# EasyEDA Pro project ProPrj_FocKnob_2025-06-09.epro

# Schematic Schematic1
Board Name: base; Create Date: 2025-02-16; Page Name: base_sch; Project Name: FocKnob; Schematic Name: Schematic1; Update Date: 2025-02-24; Page Size: A3; Version: V1.0
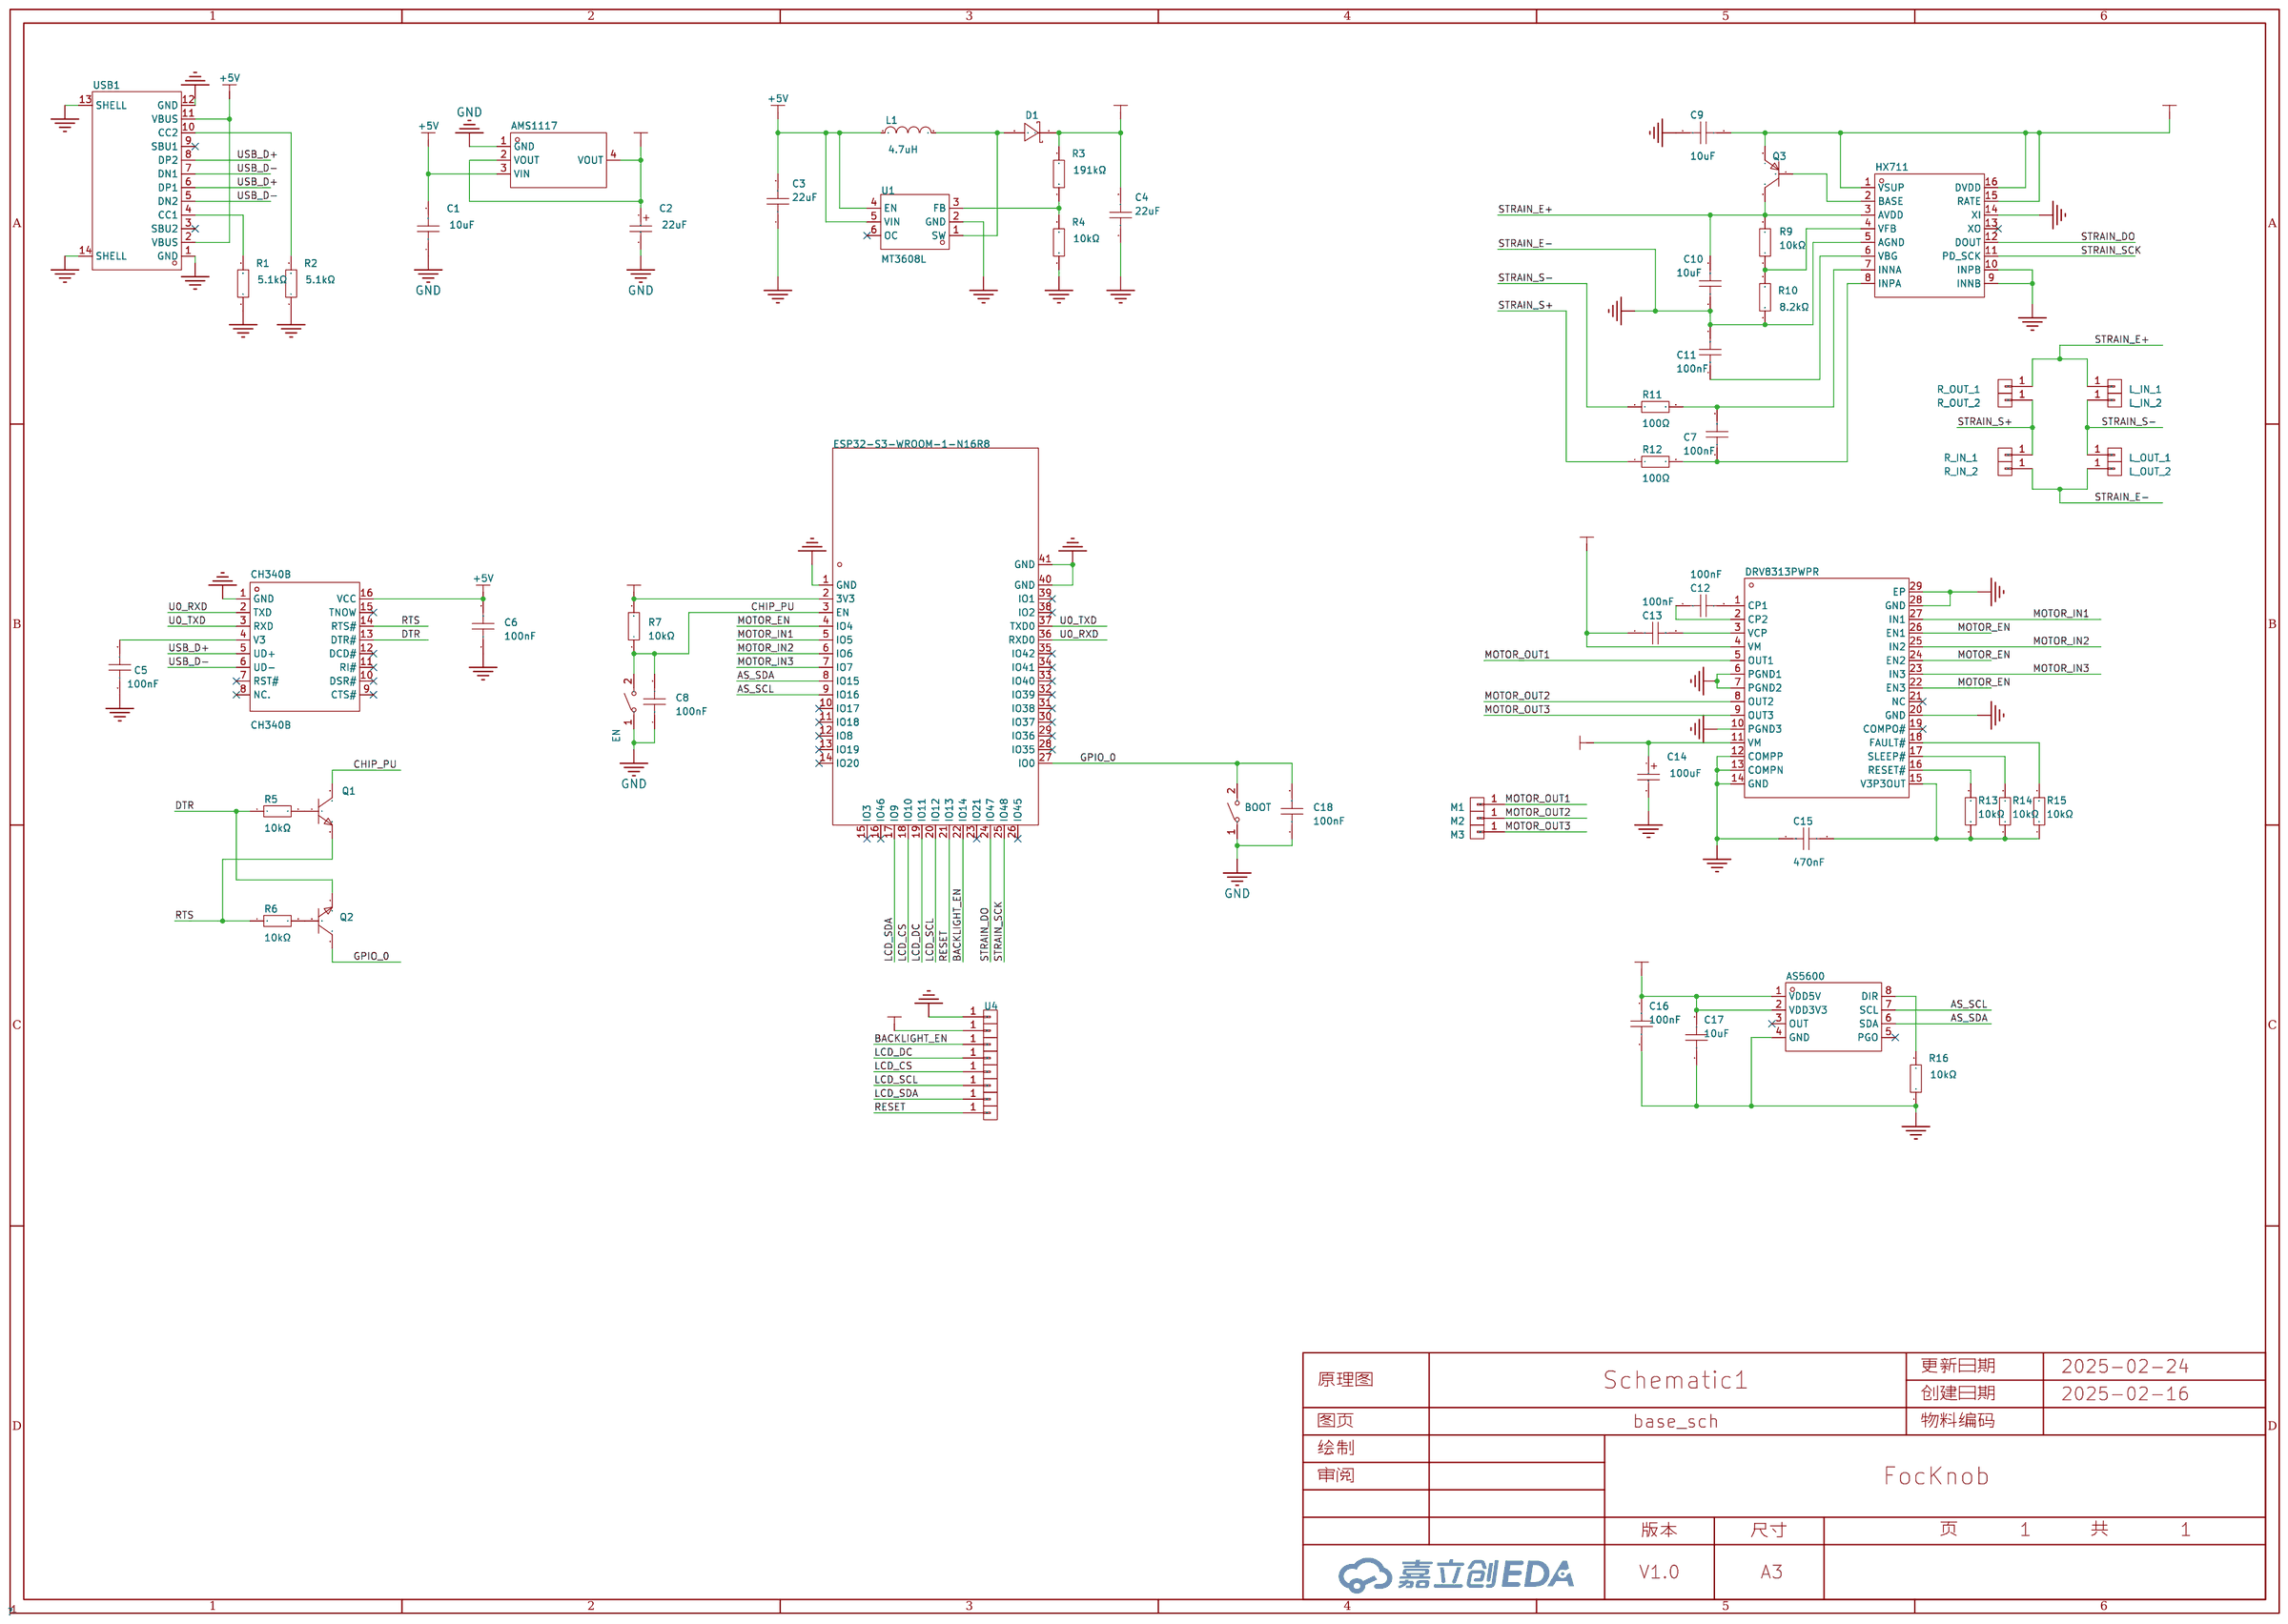
[diagram p0: schematic sheet]

## Parts
AMS1117  AMS1117-3.3  [SOT-223-3_L6.5-W3.4-P2.30-LS7.0-BR]
AS5600  AS5600-ASOT  [SOIC-8_L5.0-W4.0-P1.27-LS6.0-BL]
BOOT  TS-1088R-02026  [SW-SMD_L3.9-W3.0-P4.45]
C1  10uF  [C0603]
C2  22uF  [CASE-A_3216]
C3  22uF  [C0603]
C4  22uF  [C0603]
C5  100nF  [C0603]
C6  100nF  [C0603]
C7  100nF  [C0603]
C8  100nF  [C0603]
C9  10uF  [C0603]
C10  10uF  [C0603]
C11  100nF  [C0603]
C12  100nF  [C0603]
C13  100nF  [C0603]
C14  100uF  [CASE-D_7343]
C15  470nF  [C0603]
C16  100nF  [C0603]
C17  10uF  [C0603]
C18  100nF  [C0603]
CH340B  CH340B  [SOIC-16_L9.9-W3.9-P1.27-LS6.0-BL]
D1  SS14  [SMA_L4.2-W2.6-LS5.3-RD]
DRV8313PWPR  DRV8313PWPR  [HTSSOP-28_L9.8-W4.5-P0.65-LS6.6-BL-EP]
EN  TS-1088R-02026  [SW-SMD_L3.9-W3.0-P4.45]
ESP32-S3-WROOM-1-N16R8  ESP32-S3-WROOM-1-N16R8  [WIRELM-SMD_ESP32-S3-WROOM-1]
HX711  HX711  [SOP-16_L10.0-W3.9-P1.27-LS6.0-BL]
L1  4.7uH  [IND-SMD_L4.4-W4.2]
L_IN_1  -  [pad_1]
L_IN_2  -  [pad_1]
L_OUT_1  -  [pad_1]
L_OUT_2  -  [pad_1]
M1  -  [pad_1]
M2  -  [pad_1]
M3  -  [pad_1]
Q1  S8050  [SOT-23-3_L2.9-W1.3-P1.90-LS2.3-BR]
Q2  S8050  [SOT-23-3_L2.9-W1.3-P1.90-LS2.3-BR]
Q3  S8550  [SOT-23-3_L2.9-W1.3-P1.90-LS2.4-BR]
R1  5.1kΩ  [R0603]
R2  5.1kΩ  [R0603]
R3  191kΩ  [R0603]
R4  10kΩ  [R0603]
R5  10kΩ  [R0603]
R6  10kΩ  [R0603]
R7  10kΩ  [R0603]
R9  10kΩ  [R0603]
R10  8.2kΩ  [R0603]
R11  100Ω  [R0603]
R12  100Ω  [R0603]
R13  10kΩ  [R0603]
R14  10kΩ  [R0603]
R15  10kΩ  [R0603]
R16  10kΩ  [R0603]
R_IN_1  -  [pad_1]
R_IN_2  -  [pad_1]
R_OUT_1  -  [pad_1]
R_OUT_2  -  [pad_1]
U1  MT3608L  [SOT-23-6_L2.9-W1.6-P0.95-LS2.8-BL_3]
U4  -  [pad_1]
U5  -  [pad_1]
U6  -  [pad_1]
U7  -  [pad_1]
U8  -  [pad_1]
U9  -  [pad_1]
U10  -  [pad_1]
U11  -  [pad_1]
USB1  TYPE-C 16PIN 2MD(073)  [USB-C-SMD_TYPE-C-6PIN-2MD-073]

## Library data of the parts
AMS1117 = AMS1117-3.3_C6186: 输出类型:固定;输出极性:正;输出通道数:1;最大输入电压:-;输出电压:3.3V;压差:1.3V@(800mA);静态电流(地电流):-;输出电流:1A;电源纹波抑制比(PSRR):72dB@(120Hz);噪声:-;特性:-;工作温度:-;; LCSC Part Name: 正 Vout=3.3V 1A 72dB@(120Hz); Supplier Part: C6186; Manufacturer: AMS; Supplier Footprint: SOT-223-3; JLCPCB Part Class: Basic Part; Datasheet: https://atta.szlcsc.com/upload/public/pdf/source/20180727/C6186_7A095716F0823C02F1997A905E26C086.pdf; Supplier: LCSC; Output Type: 固定; Output Polarity: 正; Number of Outputs: 1; Output Voltage: 3.3V; Dropout Voltage: 1.3V@(800mA); Output Current: 1A; Power Supply Rejection Ratio (PSRR): 72dB@(120Hz)
AS5600 = AS5600-ASOT: 旋转角度范围:0°~360°;; Supplier Part: C499458; Manufacturer: ams(艾迈斯半导体); Supplier Footprint: SOIC-8; JLCPCB Part Class: 扩展库; Datasheet: https://atta.szlcsc.com/upload/public/pdf/source/20200324/C499458_E1461AFB0CE1042DE5756821C534625C.pdf; Supplier: LCSC; Supply Voltage: 5V；3.3V; Rotation Angle: 0°~360°
BOOT EN = TS-1088R-02026: 电路结构:单刀单掷;按钮形状:圆形按钮;安装方式:立贴;开关长度:3.9mm;开关宽度:2.93mm;开关高度:2mm;触点电流:50mA;额定电压(DC):12V;带灯:-;机械寿命:-;; LCSC Part Name: 3.9*2.93*2mm 立贴 轻触开关; Supplier Part: C455280; Manufacturer: XUNPU(讯普); Supplier Footprint: SMD,3x4mm; JLCPCB Part Class: 扩展库; Datasheet: https://atta.szlcsc.com/upload/public/pdf/source/20191118/C455281_EC5379764BC1462550DF64BBBFEA9579.pdf; Supplier: LCSC; Circuit: 单刀单掷; Actuator Style: 圆形按钮; Mounting Style: 立贴; Switch Length: 3.9mm; Switch Width: 2.93mm; Switch Height: 2mm; Contact Current: 50mA; Voltage Rating (DC): 12V
C1 C8-C10 C17 C18 = CL10A106KP8NNNC: 容值:10uF;精度:±10%;额定电压:10V;材质(温度系数):X5R;; LCSC Part Name: 10uF ±10% 10V; Supplier Part: C19702; Manufacturer: SAMSUNG(三星); Supplier Footprint: 0603; JLCPCB Part Class: Basic Part; Datasheet: https://atta.szlcsc.com/upload/public/pdf/source/20160218/1457707763339.pdf; Supplier: LCSC; Tolerance: ±10%; Voltage Rated: 10V; Temperature Coefficient: X5R
C2 = TAJA226K010RNJ: 容值:22uF;精度:±10%;额定电压:10V;等效串联电阻:3Ω@100kHz;工作温度:-55~+125;; LCSC Part Name: 22uF ±10% 10V; Supplier Part: C11366; Manufacturer: Kyocera AVX; JLCPCB Part Class: Extended Part; Datasheet: https://atta.szlcsc.com/upload/public/pdf/source/20160107/1457707744993.pdf; Supplier: LCSC; Tolerance: ±10%; Rated Voltage: 10V; Equivalent Series Resistance(ESR): 3Ω@100kHz; Operating Temperature: -55~+125
C3 C4 = CGA0603X5R226M160JT: 容值:22uF;精度:±20%;额定电压:16V;材质(温度系数):X5R;; LCSC Part Name: 22uF ±20% 16V; Supplier Part: C6119868; Manufacturer: HRE(芯声); Supplier Footprint: 0603; JLCPCB Part Class: Extended Part; Supplier: LCSC; Tolerance: ±20%; Voltage Rated: 16V; Temperature Coefficient: X5R
C5-C7 C11-C13 C16 = CC0603KRX7R9BB104: 容值:100nF;精度:±10%;额定电压:50V;材质(温度系数):X7R;; LCSC Part Name: 100nF ±10% 50V; Supplier Part: C14663; Manufacturer: YAGEO(国巨); Supplier Footprint: 0603; JLCPCB Part Class: Basic Part; Datasheet: https://atta.szlcsc.com/upload/public/pdf/source/20180910/C282072_33301C7F631E79921B82A8DAC6BCC5B3.pdf; Supplier: LCSC; Tolerance: ±10%; Voltage Rated: 50V; Temperature Coefficient: X7R
C14 = TAJD107K016RNJ: 容值:100uF;精度:±10%;额定电压:16V;等效串联电阻:600mΩ@100kHz;; LCSC Part Name: 100uF ±10% 16V; Supplier Part: C7223; Manufacturer: Kyocera AVX; Supplier Footprint: CASE-D-7343; JLCPCB Part Class: Extended Part; Datasheet: https://atta.szlcsc.com/upload/public/pdf/source/20160107/1457707750344.pdf; Supplier: LCSC; Tolerance: ±10%; Rated Voltage: 16V; Equivalent Series Resistance(ESR): 600mΩ@100kHz; Operating Temperature: -55℃~+125℃
C15 = CL10B474KA8NNNC: 容值:470nF;精度:±10%;额定电压:25V;材质(温度系数):X7R;; LCSC Part Name: 470nF ±10% 25V; Supplier Part: C1623; Manufacturer: SAMSUNG(三星); Supplier Footprint: 0603; JLCPCB Part Class: Basic Part; Datasheet: https://atta.szlcsc.com/upload/public/pdf/source/20160218/1457707763339.pdf; Supplier: LCSC; Tolerance: ±10%; Voltage Rated: 25V; Temperature Coefficient: X7R
CH340B = CH340B: 应用功能:收发器;接口协议:USB 2.0;数据速率:2Mbps;; Supplier Part: C81010; Manufacturer: WCH(南京沁恒); Supplier Footprint: SOP-16; JLCPCB Part Class: 扩展库; Datasheet: https://atta.szlcsc.com/upload/public/pdf/source/20240313/C9CDB4B2542990A8DD7A323D09462BC5.pdf; Supplier: LCSC; Applications Function: 收发器; Protocol: USB 2.0; Supply Voltage: 3.3V；5V; Data Rate: 2Mbps
D1 = SS14_C2480: 二极管配置:独立式;正向压降(Vf):550mV@1A;直流反向耐压(Vr):40V;整流电流:1A;; LCSC Part Name: 电压:40V 电流:1A; Supplier Part: C2480; Manufacturer: MDD(辰达半导体); Supplier Footprint: SMA(DO-214AC); JLCPCB Part Class: 基础库; Datasheet: https://atta.szlcsc.com/upload/public/pdf/source/20240710/EF24798823EE33D63F154ED67BAC5E71.pdf; Supplier: LCSC; Diode Configuration: 独立式; Forward Voltage (Vf@If): 550mV@1A; Reverse Voltage (Vr): 40V; Rectified Current: 1A; Reverse Leakage Current (Ir): 300uA@40V
DRV8313PWPR = DRV8313PWPR: DRV8313 具有集成 FET、65V 最大电压、3A 峰值电流的三相电机驱动器; LCSC Part Name: 无刷直流BLDC电机驱动芯片 60V; Supplier Part: C92482; Manufacturer: TI(德州仪器); Supplier Footprint: HTSSOP-28-EP-4.5mm; JLCPCB Part Class: 扩展库; Datasheet: https://www.ti.com/cn/lit/gpn/drv8313; Supplier: LCSC
ESP32-S3-WROOM-1-N16R8 = ESP32-S3-WROOM-1-N16R8: LCSC Part Name: 通用型Wi-Fi+低功耗蓝牙MCU模组; Supplier Part: C2913202; Manufacturer: ESPRESSIF(乐鑫); Supplier Footprint: SMD,18x25.5mm; JLCPCB Part Class: 扩展库; Datasheet: https://atta.szlcsc.com/upload/public/pdf/source/20220705/4E799F39581577F766659887F738A439.pdf; Supplier: LCSC
HX711 = HX711_C6705483: 分辨率:24位;电源电压:2.7V~5.5V;; Supplier Part: C6705483; Manufacturer: AVIA(海芯科技); Supplier Footprint: SOP-16; JLCPCB Part Class: 扩展库; Datasheet: https://atta.szlcsc.com/upload/public/pdf/source/20240910/523FF17855B2F1313F971C77291F913D.pdf; Supplier: LCSC; resolution: 24位; number of channels: 2; Supply Voltage: 2.7V~5.5V; differential input: 是; Operating Temperature: -40~+85
L1 = FXL0420-4R7-M: 电感值:4.7uH;精度:±20%;额定电流:2.8A;饱和电流(Isat):3A;类型:一体成型电感;; LCSC Part Name: 4.7uH ±20% 3A; Supplier Part: C167208; Manufacturer: cjiang(长江微电); Supplier Footprint: SMD,4.2x4.4mm; JLCPCB Part Class: Extended Part; Datasheet: https://atta.szlcsc.com/upload/public/pdf/source/20240426/3189EA8206330E2108542F9E34E540E7.pdf; Supplier: LCSC; Tolerance: ±20%; Rated Current: 2.8A; Saturation Current (Isat): 3A; DC Resistance (DCR): 105mΩ; Type: 一体成型电感
L_IN_1 L_IN_2 L_OUT_1 L_OUT_2 M1-M3 R_IN_1 R_IN_2 R_OUT_1 R_OUT_2 U4-U11 = pad_1
Q1 Q2 = S8050_C20069125: 晶体管类型:NPN;集电极电流(Ic):500mA;集射极击穿电压(Vceo):25V;功率(Pd):300mW;直流电流增益(hFE@Ic,Vce):120@50mA,1.0V;; LCSC Part Name: hFE:200-350，丝印:J3Y; Supplier Part: C20069125; Manufacturer: 宏迦橙; Supplier Footprint: SOT-23; JLCPCB Part Class: Extended Part; Datasheet: https://atta.szlcsc.com/upload/public/pdf/source/20240403/2D78449C96B6E27F13BF8BDF79E27159.pdf; Supplier: LCSC; Transistor Type: NPN; Collector Current (Ic): 500mA; Collector-Emitter Breakdown Voltage (Vceo): 25V; Power Dissipation (Pd): 300mW; DC Current Gain (hFE@Ic,Vce): 120@50mA,1.0V; Transition Frequency (fT): 100MHz; Collector Cut-Off Current (Icbo): 100nA; Collector-Emitter Saturation Voltage (VCE(sat)@Ic,Ib): 600mV@500mA,50mA; Operating Temperature: -55℃~+150℃
Q3 = S8550_C20069126: 晶体管类型:PNP;集电极电流(Ic):500mA;集射极击穿电压(Vceo):25V;功率(Pd):300mW;直流电流增益(hFE@Ic,Vce):120@500mA,1.0V;; LCSC Part Name: hFE:200-350，丝印:2TY; Supplier Part: C20069126; Manufacturer: 宏迦橙; Supplier Footprint: SOT-23; JLCPCB Part Class: Extended Part; Datasheet: https://atta.szlcsc.com/upload/public/pdf/source/20231229/A44F382554E15234B24C32D7C3971EED.pdf; Supplier: LCSC; Transistor Type: PNP; Collector Current (Ic): 500mA; Collector-Emitter Breakdown Voltage (Vceo): 25V; Power Dissipation (Pd): 300mW; DC Current Gain (hFE@Ic,Vce): 120@500mA,1.0V; Transition Frequency (fT): 150MHz; Collector Cut-Off Current (Icbo): 100nA; Collector-Emitter Saturation Voltage (VCE(sat)@Ic,Ib): 500mV@1.0A,50mA; Operating Temperature: -55℃~+150℃
R1 R2 = 0603WAF5101T5E: 电阻类型:厚膜电阻;阻值:5.1kΩ;精度:±1%;功率:100mW;最大工作电压:75V;温度系数:±100ppm/℃;; LCSC Part Name: 5.1kΩ ±1% 100mW 厚膜电阻; Supplier Part: C23186; Manufacturer: UNI-ROYAL(厚声); Supplier Footprint: 0603; JLCPCB Part Class: Basic Part; Datasheet: https://atta.szlcsc.com/upload/public/pdf/source/20200306/C422600_1E6D84923E4A46A82E41ADD87F860B5C.pdf; Supplier: LCSC; Type: 厚膜电阻; Tolerance: ±1%; Power(Watts): 100mW; Overload Voltage (Max): 75V; Temperature Coefficient: ±100ppm/℃; Operating Temperature Range: -55℃~+155℃
R3 = ERA3AEB1913V: 电阻类型:薄膜电阻;阻值:191kΩ;精度:±0.1%;功率:100mW;最大工作电压:75V;温度系数:±25ppm/℃;; LCSC Part Name: 薄膜电阻 191kΩ ±0.1% 100mW; Supplier Part: C491119; Manufacturer: PANASONIC(松下); Supplier Footprint: 0603; JLCPCB Part Class: Extended Part; Datasheet: https://atta.szlcsc.com/upload/public/pdf/source/20200407/C491119_377C38571D4E885D6F5A34CE23F2FBE8.pdf; Supplier: LCSC; Type: 薄膜电阻; Tolerance: ±0.1%; Power(Watts): 100mW; Overload Voltage (Max): 75V; Temperature Coefficient: ±25ppm/℃; Operating Temperature Range: -55℃~+155℃
R4-R7 R9 R13-R16 = 0603WAF1002T5E: 电阻类型:厚膜电阻;阻值:10kΩ;精度:±1%;功率:100mW;最大工作电压:75V;温度系数:±100ppm/℃;; LCSC Part Name: 厚膜电阻 10kΩ ±1% 100mW; Supplier Part: C25804; Manufacturer: UNI-ROYAL(厚声); Supplier Footprint: 0603; JLCPCB Part Class: Basic Part; Datasheet: https://atta.szlcsc.com/upload/public/pdf/source/20200306/C422600_1E6D84923E4A46A82E41ADD87F860B5C.pdf; Supplier: LCSC; Type: 厚膜电阻; Tolerance: ±1%; Power(Watts): 100mW; Overload Voltage (Max): 75V; Temperature Coefficient: ±100ppm/℃; Operating Temperature Range: -55℃~+155℃
R10 = 0603WAF8201T5E: 电阻类型:厚膜电阻;阻值:8.2kΩ;精度:±1%;功率:100mW;最大工作电压:75V;温度系数:±100ppm/℃;; LCSC Part Name: 8.2kΩ ±1% 100mW 厚膜电阻; Supplier Part: C25981; Manufacturer: UNI-ROYAL(厚声); Supplier Footprint: 0603; JLCPCB Part Class: Basic Part; Datasheet: https://atta.szlcsc.com/upload/public/pdf/source/20200306/C422600_1E6D84923E4A46A82E41ADD87F860B5C.pdf; Supplier: LCSC; Type: 厚膜电阻; Tolerance: ±1%; Power(Watts): 100mW; Overload Voltage (Max): 75V; Temperature Coefficient: ±100ppm/℃; Operating Temperature Range: -55℃~+155℃
R11 R12 = 0603WAF1000T5E: 电阻类型:厚膜电阻;阻值:100Ω;精度:±1%;功率:100mW;最大工作电压:75V;温度系数:±200ppm/℃;; LCSC Part Name: 100Ω ±1% 100mW 厚膜电阻; Supplier Part: C22775; Manufacturer: UNI-ROYAL(厚声); Supplier Footprint: 0603; JLCPCB Part Class: Basic Part; Datasheet: https://atta.szlcsc.com/upload/public/pdf/source/20200306/C422600_1E6D84923E4A46A82E41ADD87F860B5C.pdf; Supplier: LCSC; Type: 厚膜电阻; Tolerance: ±1%; Power(Watts): 100mW; Overload Voltage (Max): 75V; Temperature Coefficient: ±200ppm/℃; Operating Temperature Range: -55℃~+155℃
U1 = MT3608L: 工作电压:2.2V~16V;输出电流:2.5A;; LCSC Part Name: 高效2.5A 1.2MHz升压转换器; Supplier Part: C2932326; Manufacturer: 西安航天民芯; Supplier Footprint: SOT-23-6; JLCPCB Part Class: 扩展库; Datasheet: https://atta.szlcsc.com/upload/public/pdf/source/20211213/953A62CC1033762E00AABAD4906DD7F1.pdf; Supplier: LCSC; Input Voltage: 2.2V~16V; Output Current: 2.5A; Number of Outputs: 1
USB1 = TYPE-C 16PIN 2MD(073): 连接器类型:Type-C;标准:USB 3.1;公母:母;安装方式:卧贴;触点数量:16P;端口数量:1;额定电流 - 电源:5A;工作温度范围:-25~+85;; LCSC Part Name: Type-C 母 卧贴; Supplier Part: C2765186; Manufacturer: SHOU HAN(首韩); Supplier Footprint: SMD; JLCPCB Part Class: 扩展库; Datasheet: https://atta.szlcsc.com/upload/public/pdf/source/20211123/39B17C16241EAC15C5E277BDA434118E.pdf; Supplier: LCSC; Connector Type: Type-C; Standard: USB 3.1; Gender: 母; Mounting Style: 卧贴; Number of Contacts: 16P; Number of Ports: 1; Current Rating - Power (Max): 5A; Operating Temperature Range: -25~+85; Rated Voltage (Max): 5V; Connect-Disconnect Life: 5千次; Core Colour: 黑色

## Nets
+3.3V: AMS1117.2(VOUT) AMS1117.4(VOUT) AS5600.1(VDD5V) AS5600.2(VDD3V3) C2.1 C9.2 C16.2 C17.2 ESP32-S3-WROOM-1-N16R8.2(3V3) HX711.1(VSUP) HX711.15(RATE) HX711.16(DVDD) Q3.2(E) R7.2 U5.1(Pin)
+5V: AMS1117.3(VIN) C1.2 C3.2 C6.2 CH340B.16(VCC) L1.1 U1.4(EN) U1.5(VIN) USB1.2(VBUS) USB1.11(VBUS)
+12V: C4.2 C13.1 C14.1 D1.1(K) DRV8313PWPR.4(VM) DRV8313PWPR.11(VM) R3.2
GND: AMS1117.1(GND) AS5600.4(GND) BOOT.1 C1.1 C2.2 C3.1 C4.1 C5.1 C6.1 C8.1 C9.1 C14.2 C15.1 C16.1 C17.1 C18.1 CH340B.1(GND) DRV8313PWPR.6(PGND1) DRV8313PWPR.7(PGND2) DRV8313PWPR.10(PGND3) DRV8313PWPR.12(COMPP) DRV8313PWPR.13(COMPN) DRV8313PWPR.14(GND) DRV8313PWPR.20(GND) DRV8313PWPR.28(GND) DRV8313PWPR.29(EP) EN.1 ESP32-S3-WROOM-1-N16R8.1(GND) ESP32-S3-WROOM-1-N16R8.40(GND) ESP32-S3-WROOM-1-N16R8.41(GND) HX711.9(INNB) HX711.10(INPB) HX711.14(XI) R1.1 R2.1 R4.1 R16.1 U1.2(GND) U4.1(Pin) USB1.1(GND) USB1.12(GND) USB1.13(SHELL) USB1.14(SHELL)
AS_SCL: AS5600.7(SCL) ESP32-S3-WROOM-1-N16R8.9(IO16)
AS_SDA: AS5600.6(SDA) ESP32-S3-WROOM-1-N16R8.8(IO15)
BACKLIGHT_EN: ESP32-S3-WROOM-1-N16R8.22(IO14) U6.1(Pin)
CHIP_PU: C8.2 EN.2 ESP32-S3-WROOM-1-N16R8.3(EN) Q1.3(C) R7.1
DTR: CH340B.13(DTR#) Q2.2(B) R5.1
GPIO_0: BOOT.2 C18.2 ESP32-S3-WROOM-1-N16R8.27(IO0) Q2.3(C)
LCD_CS: ESP32-S3-WROOM-1-N16R8.18(IO10) U8.1(Pin)
LCD_DC: ESP32-S3-WROOM-1-N16R8.19(IO11) U7.1(Pin)
LCD_SCL: ESP32-S3-WROOM-1-N16R8.20(IO12) U9.1(Pin)
LCD_SDA: ESP32-S3-WROOM-1-N16R8.17(IO9) U10.1(Pin)
MOTOR_EN: DRV8313PWPR.22(EN3) DRV8313PWPR.24(EN2) DRV8313PWPR.26(EN1) ESP32-S3-WROOM-1-N16R8.4(IO4)
MOTOR_IN1: DRV8313PWPR.27(IN1) ESP32-S3-WROOM-1-N16R8.5(IO5)
MOTOR_IN2: DRV8313PWPR.25(IN2) ESP32-S3-WROOM-1-N16R8.6(IO6)
MOTOR_IN3: DRV8313PWPR.23(IN3) ESP32-S3-WROOM-1-N16R8.7(IO7)
MOTOR_OUT1: DRV8313PWPR.5(OUT1) M1.1(Pin)
MOTOR_OUT2: DRV8313PWPR.8(OUT2) M2.1(Pin)
MOTOR_OUT3: DRV8313PWPR.9(OUT3) M3.1(Pin)
RESET: ESP32-S3-WROOM-1-N16R8.21(IO13) U11.1(Pin)
RTS: CH340B.14(RTS#) Q1.2(B) R6.1
STRAIN_DO: ESP32-S3-WROOM-1-N16R8.24(IO47) HX711.12(DOUT)
STRAIN_E+: C10.2 HX711.3(AVDD) L_IN_1.1(Pin) Q3.3(C) R9.2 R_OUT_1.1(Pin)
STRAIN_E-: C10.1 C11.2 HX711.5(AGND) L_OUT_2.1(Pin) R10.1 R_IN_2.1(Pin)
STRAIN_S+: R12.1 R_IN_1.1(Pin) R_OUT_2.1(Pin)
STRAIN_S-: L_IN_2.1(Pin) L_OUT_1.1(Pin) R11.1
STRAIN_SCK: ESP32-S3-WROOM-1-N16R8.25(IO48) HX711.11(PD_SCK)
U0_RXD: CH340B.2(TXD) ESP32-S3-WROOM-1-N16R8.36(RXD0)
U0_TXD: CH340B.3(RXD) ESP32-S3-WROOM-1-N16R8.37(TXD0)
USB_D+: CH340B.5(UD+) USB1.6(DP1) USB1.8(DP2)
USB_D-: CH340B.6(UD-) USB1.5(DN2) USB1.7(DN1)
$1N3637: R1.2 USB1.4(CC1)
$1N3643: R2.2 USB1.10(CC2)
$1N5320: D1.2(A) L1.2 U1.1(SW)
$1N5372: R3.1 R4.2 U1.3(FB)
$1N8253: Q1.1(E) R5.2
$1N8333: Q2.1(E) R6.2
$1N12316: HX711.2(BASE) Q3.1(B)
$1N12656: HX711.4(VFB) R9.1 R10.2
$1N13236: C11.1 HX711.6(VBG)
$1N14367: C7.2 HX711.7(INNA) R11.2
$1N14538: C7.1 HX711.8(INPA) R12.2
$1N16382: C12.2 DRV8313PWPR.1(CP1)
$1N16452: C12.1 DRV8313PWPR.2(CP2)
$1N16900: C13.2 DRV8313PWPR.3(VCP)
$1N20514: C15.2 DRV8313PWPR.15(V3P3OUT) R13.1 R14.1 R15.1
$1N20610: DRV8313PWPR.16(RESET#) R13.2
$1N20702: DRV8313PWPR.17(SLEEP#) R14.2
$1N20794: DRV8313PWPR.18(FAULT#) R15.2
$1N22757: AS5600.8(DIR) R16.2
$1N33956: C5.2 CH340B.4(V3)

Not connected (* = marked no-connect by the designer): AS5600 3(OUT)* 5(PGO)*; CH340B 7(RST#)* 8(NC.)* 9(CTS#)* 10(DSR#)* 11(RI#)* 12(DCD#)* 15(TNOW)*; DRV8313PWPR 19(COMPO#)* 21(NC)*; ESP32-S3-WROOM-1-N16R8 10(IO17)* 11(IO18)* 12(IO8)* 13(IO19)* 14(IO20)* 15(IO3)* 16(IO46)* 23(IO21)* 26(IO45)* 28(IO35)* 29(IO36)* 30(IO37)* 31(IO38)* 32(IO39)* 33(IO40)* 34(IO41)* 35(IO42)* 38(IO2)* 39(IO1)*; HX711 13(XO)*; U1 6(OC)*; USB1 3(SBU2)* 9(SBU1)*

# Schematic Schematic2
Board Name: screen; Create Date: 2025-02-17; Page Name: screen_sch; Project Name: FocKnob; Schematic Name: Schematic2; Update Date: 2025-02-17; Company: 嘉立创EDA; Page Size: A3; Version: V1.0
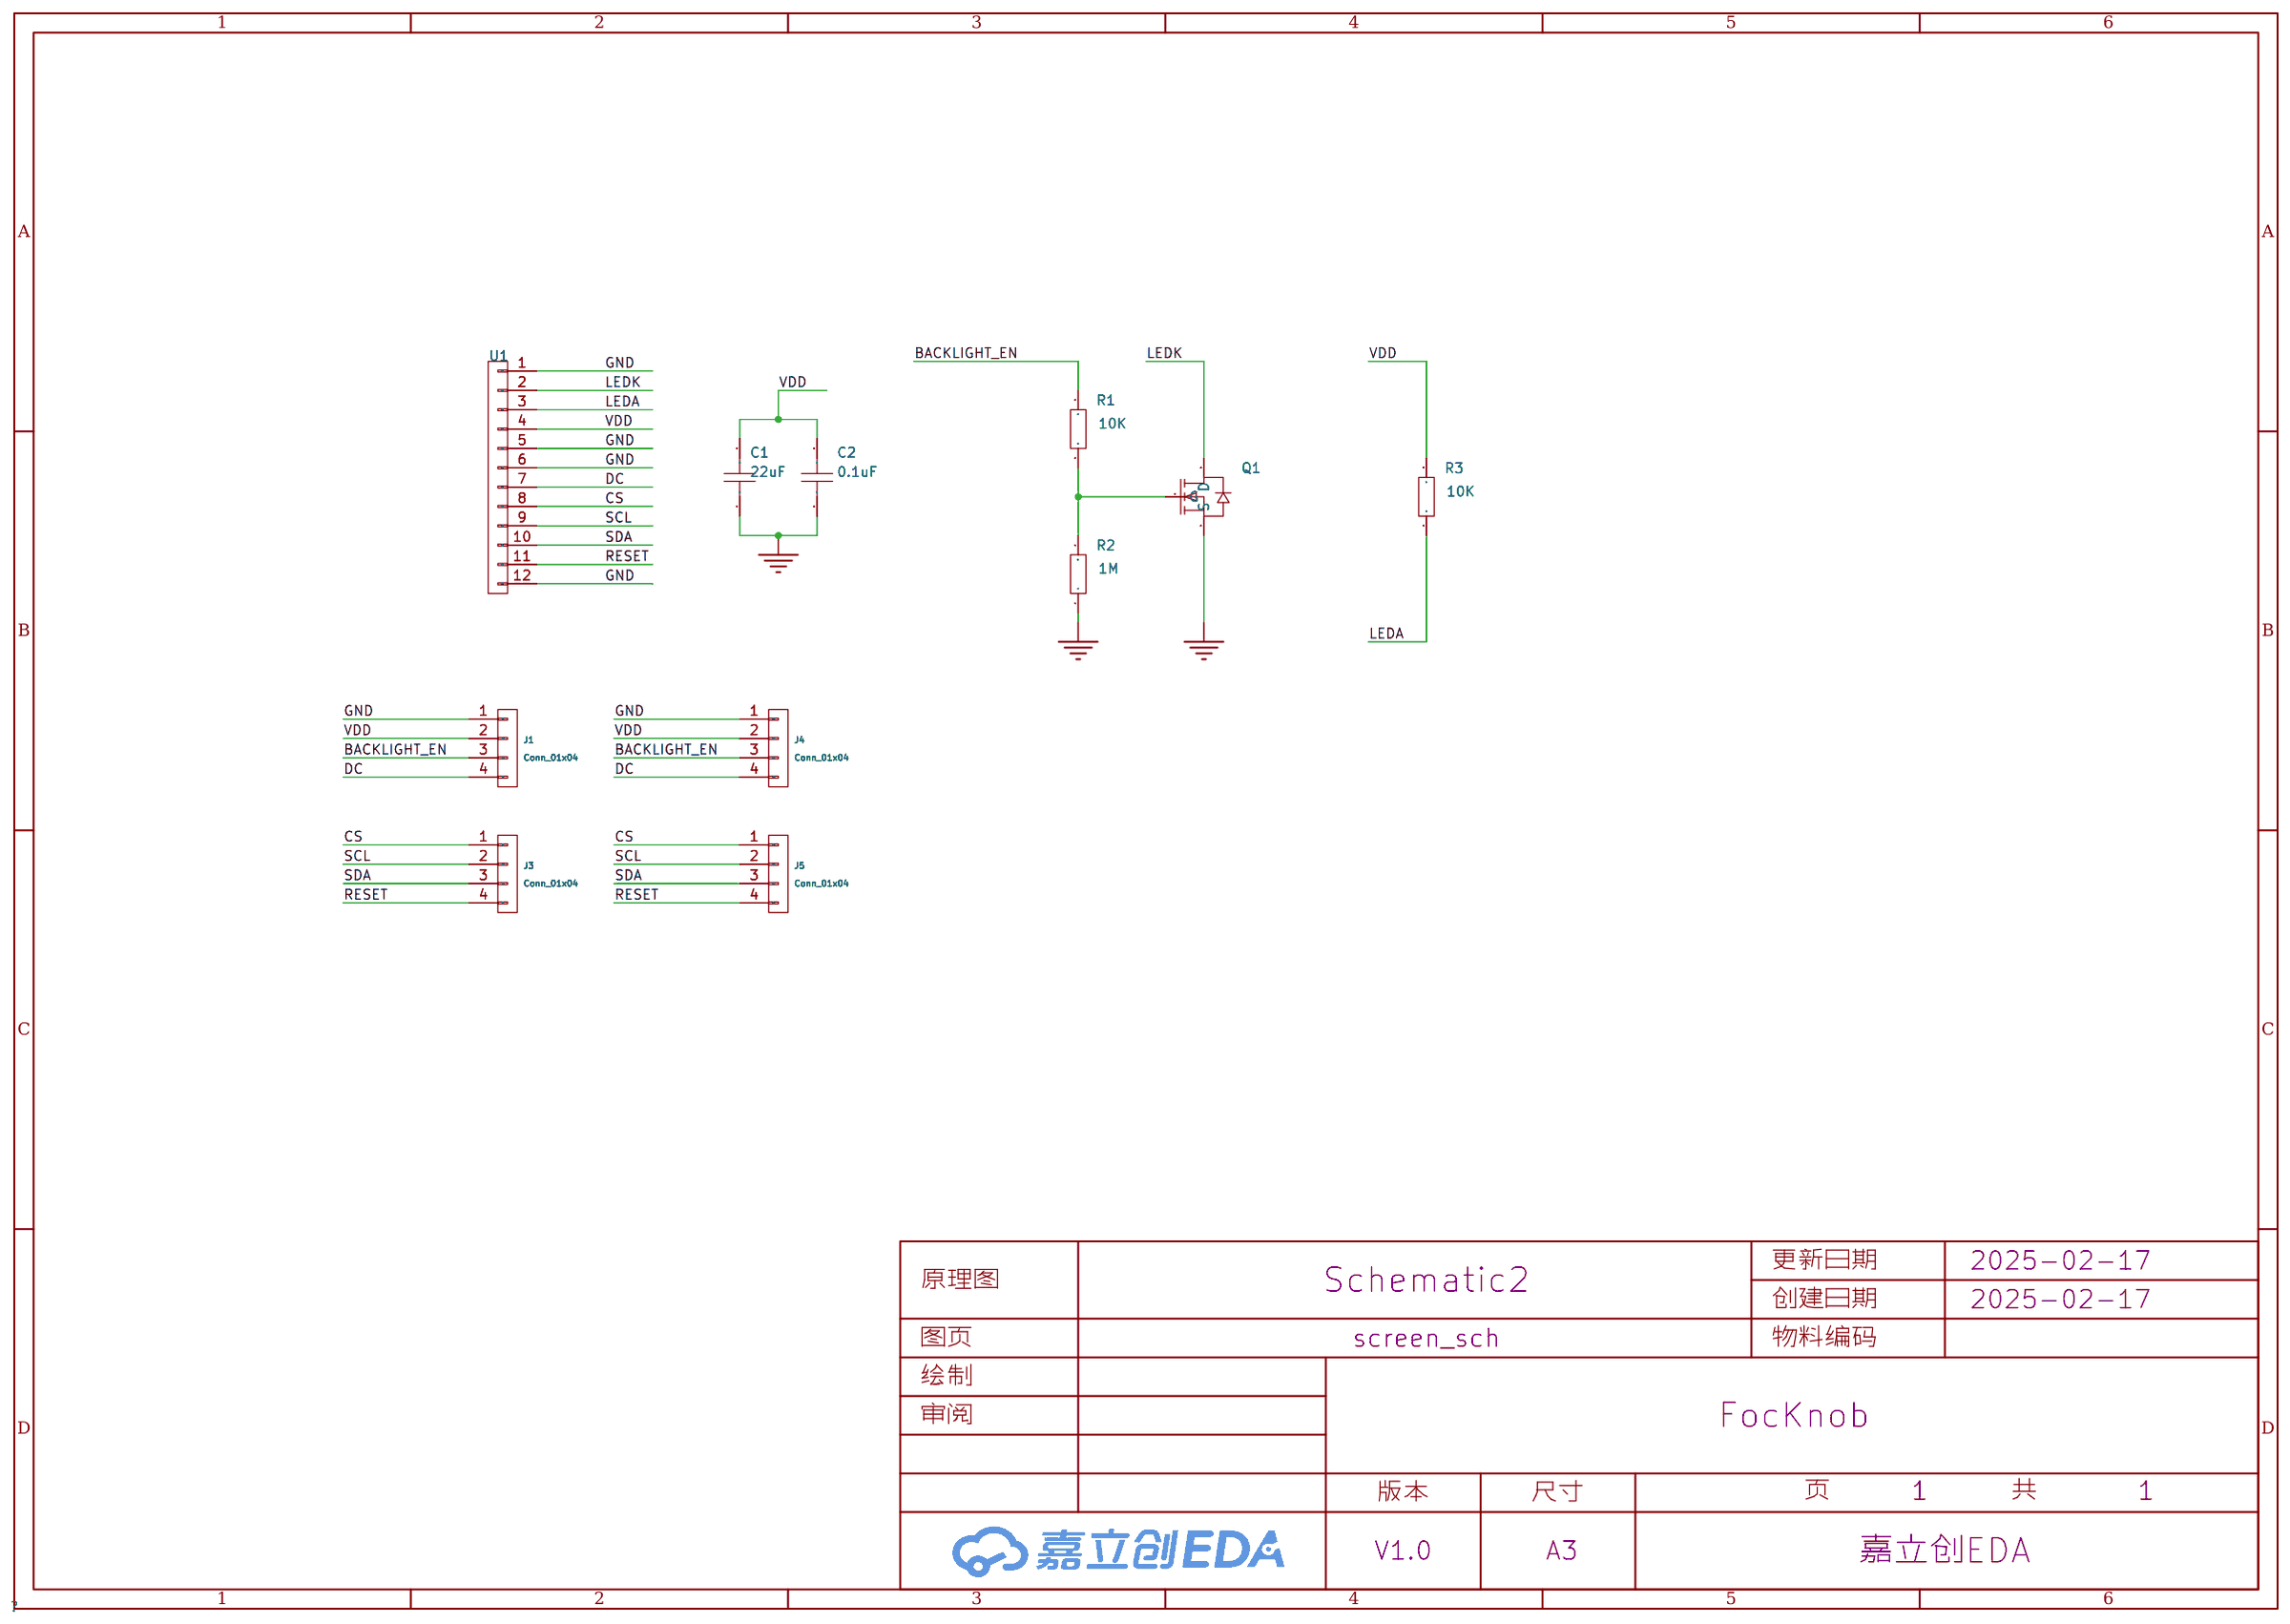
[diagram p1: schematic sheet]

## Parts
C1  22uF  [C0603]
C2  0.1uF  [C0603]
J1  Conn_01x04  [SolderPads:SolderPads_2mm_4]
J3  Conn_01x04  [SolderPads:SolderPads_2mm_4]
J4  Conn_01x04  [SolderPads:SolderPads_2mm_4]
J5  Conn_01x04  [SolderPads:SolderPads_2mm_4]
Q1  -  [SOT-23-3_L2.9-W1.3-P1.90-LS2.4-BR]
R1  10K  [R0603]
R2  1M  [R0603]
R3  10K  [R0603]
U1  -  [GC9A01_fold]

## Library data of the parts
C1 C2 = CAP_0603: Supplier Footprint: 0603
J1 J3-J5 = Connector_Generic_Conn_01x04
Q1 = AO3400A_N: 类型:N沟道;漏源电压(Vdss):30V;连续漏极电流(Id):5.2A;功率(Pd):1W;导通电阻(RDS(on)@Vgs,Id):35mΩ@10V,5A;阈值电压(Vgs(th)@Id):1.5V@250A;; Supplier Footprint: SOT-23; Supplier Part: C700953
R1-R3 = Res_0603: Supplier Footprint: 0603
U1 = GC9A01_fold

## Nets
GND: C1.1 C2.1 J1.1(Pin) J4.1(Pin) Q1.2(S) R2.1 U1.1(Pin) U1.5(Pin) U1.6(Pin) U1.12(Pin)
VDD: C1.2 C2.2 J1.2(Pin) J4.2(Pin) R3.2 U1.4(Pin)
BACKLIGHT_EN: J1.3(Pin) J4.3(Pin) R1.2
CS: J3.1(Pin) J5.1(Pin) U1.8(Pin)
DC: J1.4(Pin) J4.4(Pin) U1.7(Pin)
LEDA: R3.1 U1.3(Pin)
LEDK: Q1.3(D) U1.2(Pin)
RESET: J3.4(Pin) J5.4(Pin) U1.11(Pin)
SCL: J3.2(Pin) J5.2(Pin) U1.9(Pin)
SDA: J3.3(Pin) J5.3(Pin) U1.10(Pin)
$1N1130: Q1.1(G) R1.1 R2.2

# Board screen_pcb
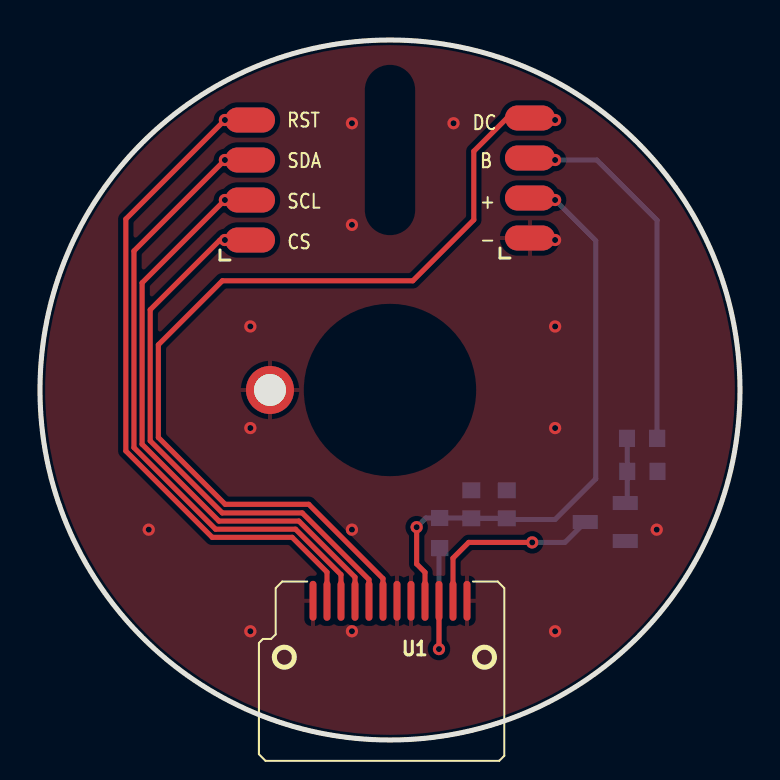
[diagram p2: board, top side]
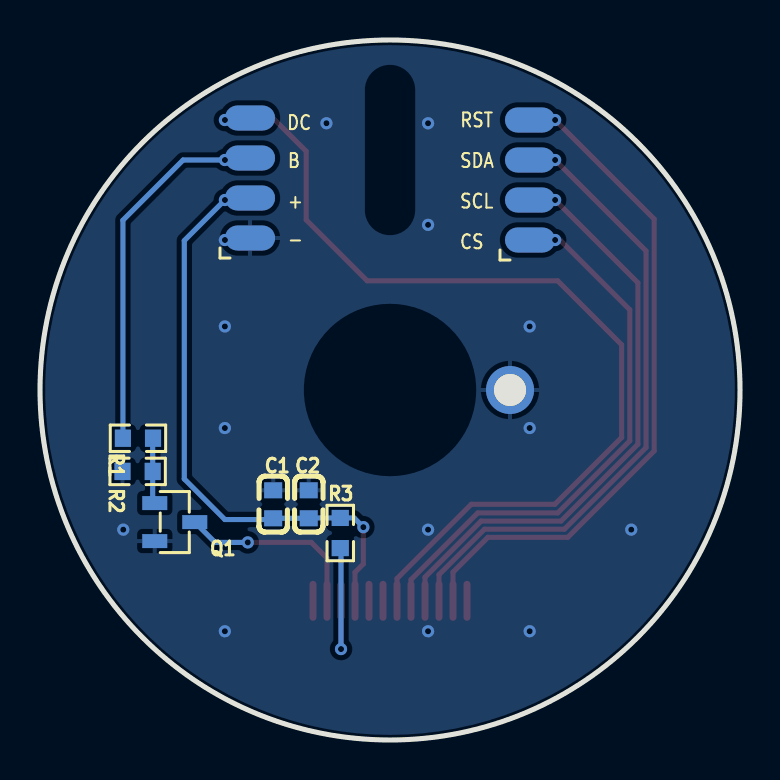
[diagram p3: board, bottom side, seen from below]

Outline 35 x 35 mm; copper layers: Top Layer, Bottom Layer. Coordinates in mm from the lower left corner of the outline.
Outline path: circle c17.5,17.5 r17.5
Stack: Top Layer 0.035mm / Dielectric1 1.51mm FR4 er 4.5 / Bottom Layer 0.035mm

## Design rules (mm)
spacing safeClearance (default): track to track 0.152, other pairs 0.152 to 0.3
track width trackWidth (default): min 0.127, default 0.254, max 2.54
differential pair differentialPair (default): width min 0.127, default 0.254, max 2.54; gap min 0.152, default 0.152
via viaSize (default): diameter min 0.5, default 0.61, max 10; hole min 0.3, default 0.305, max 6

## Placement (name value [footprint] x y rotation side)
C1  22uF  [C0603]  23.34 11.79 270 bottom
C2  0.1uF  [C0603]  21.56 11.79 270 bottom
J1  Conn_01x04  [SolderPads:SolderPads_2mm_4]  24.5 25.1 90 top
J3  Conn_01x04  [SolderPads:SolderPads_2mm_4]  10.5 25 90 top
J4  Conn_01x04  [SolderPads:SolderPads_2mm_4]  24.5 25.1 90 bottom
J5  Conn_01x04  [SolderPads:SolderPads_2mm_4]  10.5 25 90 bottom
NOREF  -  [Pad_e304]  11.5 17.5 0 top
Q1  -  [SOT-23-3_L2.9-W1.3-P1.90-LS2.4-BR]  28.26 10.9 0 bottom
R1  10K  [R0603]  30.1 15.09 0 bottom
R2  1M  [R0603]  30.12 13.43 180 bottom
R3  10K  [R0603]  19.99 10.35 90 bottom
U1  -  [GC9A01_fold]  24.87 -2.31 0 top

## Footprints (pads in the part's own frame, mm; a bottom-side part is the same pattern mirrored in y, then rotated)
C0603
  rect 0.8x0.9 smd: 1(-0.7,0) 2(0.7,0)
GC9A01_fold
  rrect 0.35x2 smd: 1(-3.516,9.271) 2(-4.216,9.271) 3(-4.916,9.271) 4(-5.616,9.271) 5(-6.316,9.271) 6(-7.016,9.271) 7(-7.716,9.271) 8(-8.416,9.271) 9(-9.116,9.271) 10(-9.816,9.271) 11(-10.516,9.271) 12(-11.216,9.271)
Pad_e304
  round 2.4 hole 1.6: 1(0,0)
R0603
  rect 0.806x0.864 smd: 1(-0.753,0) 2(0.753,0)
SolderPads:SolderPads_2mm_4
  oval 1.25x2.5 smd: 1(0,0) 2(2,0) 3(4,0) 4(6,0)
SOT-23-3_L2.9-W1.3-P1.90-LS2.4-BR
  rect 1.25x0.7 smd: 1(1,-0.95) 2(1,0.95) 3(-1,0)

## Nets
As in the schematic, except:
GND: C1.1 C2.1 J1.1 J4.1 NOREF.1 Q1.2 R2.1 U1.1 U1.5 U1.6 U1.12

## Via types
v1: diameter 0.61, hole 0.305, Top Layer to Bottom Layer, 24 vias

## Routing (per net, layer and track width the routed paths; a pad name or vN(x,y) marks a point on that pad's centre or on a via; arc(x,y) is an arc through that point)
GND:
  vias: v1(5.44,10.52) v1(10.52,20.68) v1(10.52,15.6) v1(10.52,5.44) v1(15.6,30.84) v1(15.6,25.76) v1(15.6,10.52) v1(15.6,5.44) v1(20.68,30.84) v1(25.76,25) v1(25.76,20.68) v1(25.76,15.6) v1(25.76,5.44) v1(30.84,10.52)
VDD: length 28.7
  Top Layer w0.254: 19.25,6.96 19.25,8.38 18.83,8.8 v1(18.83,10.64)
  Bottom Layer w0.254: v1(25.76,27) 27.79,24.97 27.79,13.06 25.76,11.02 23.4,11.02 C1.2 C2.2 21.55,11.1 R3.2 19.29,11.1 v1(18.83,10.64)
BACKLIGHT_EN: length 17.2
  Bottom Layer w0.254: R1.2 30.86,25.99 27.84,29 v1(25.76,29)
CS: length 26.6
  Top Layer w0.254: 16.45,6.96 16.45,8.02 13.11,11.35 9.12,11.35 5.51,14.96 5.51,21.51 9,25 v1(9.25,25)
DC: length 45.2
  Top Layer w0.254: 17.15,6.96 17.15,8.07 13.44,11.79 9.26,11.79 5.92,15.13 5.92,19.76 9.12,22.96 18.64,22.96 21.69,26.01 21.69,29.44 23.35,31.1 J1.4
  vias: v1(25.76,31)
LEDA: length 7.5
  Top Layer w0.254: 19.95,6.96 v1(19.95,4.55)
  Bottom Layer w0.254: v1(19.95,4.55) 19.95,9.56 R3.1
LEDK: length 9.5
  Top Layer w0.254: v1(24.61,9.88) 21.44,9.88 20.65,9.09 20.65,6.96
  Bottom Layer w0.254: v1(24.61,9.88) 26.25,9.88 Q1.3
RESET: length 32.6
  Top Layer w0.254: v1(9.25,31) 4.29,26.05 4.29,14.45 8.61,10.13 12.61,10.13 14.35,8.39 14.35,6.96
SCL: length 28.5
  Top Layer w0.254: 15.75,6.96 15.75,8.14 12.94,10.95 8.95,10.95 5.11,14.79 5.11,22.86 v1(9.25,27)
SDA: length 30.6
  Top Layer w0.254: v1(9.25,29) 4.7,24.45 4.7,14.62 8.78,10.54 12.78,10.54 15.05,8.27 15.05,6.96
$1N1130: length 3.3
  Bottom Layer w0.254: Q1.1 29.37,11.95 R2.2 29.37,15.07 R1.1

## Copper pours and planes (outline as drawn; the poured copper is in the pictures)
GND on Top Layer: -2.18,37.95 39.34,37.95 39.34,-3.45 -2.18,-3.45
GND on Bottom Layer: -3.71,37.82 42.27,37.82 42.27,-7.65 -3.71,-7.65
GND on Bottom Layer: -2.69,36.93 36.93,36.93 36.93,-2.57 -2.69,-2.57

## Text on the board
Bottom Silkscreen Layer: RST | SDA | SCL | CS | B | + | - | DC
Top Silkscreen Layer: RST | SDA | SCL | CS | DC | B | + | -

# Board base_pcb
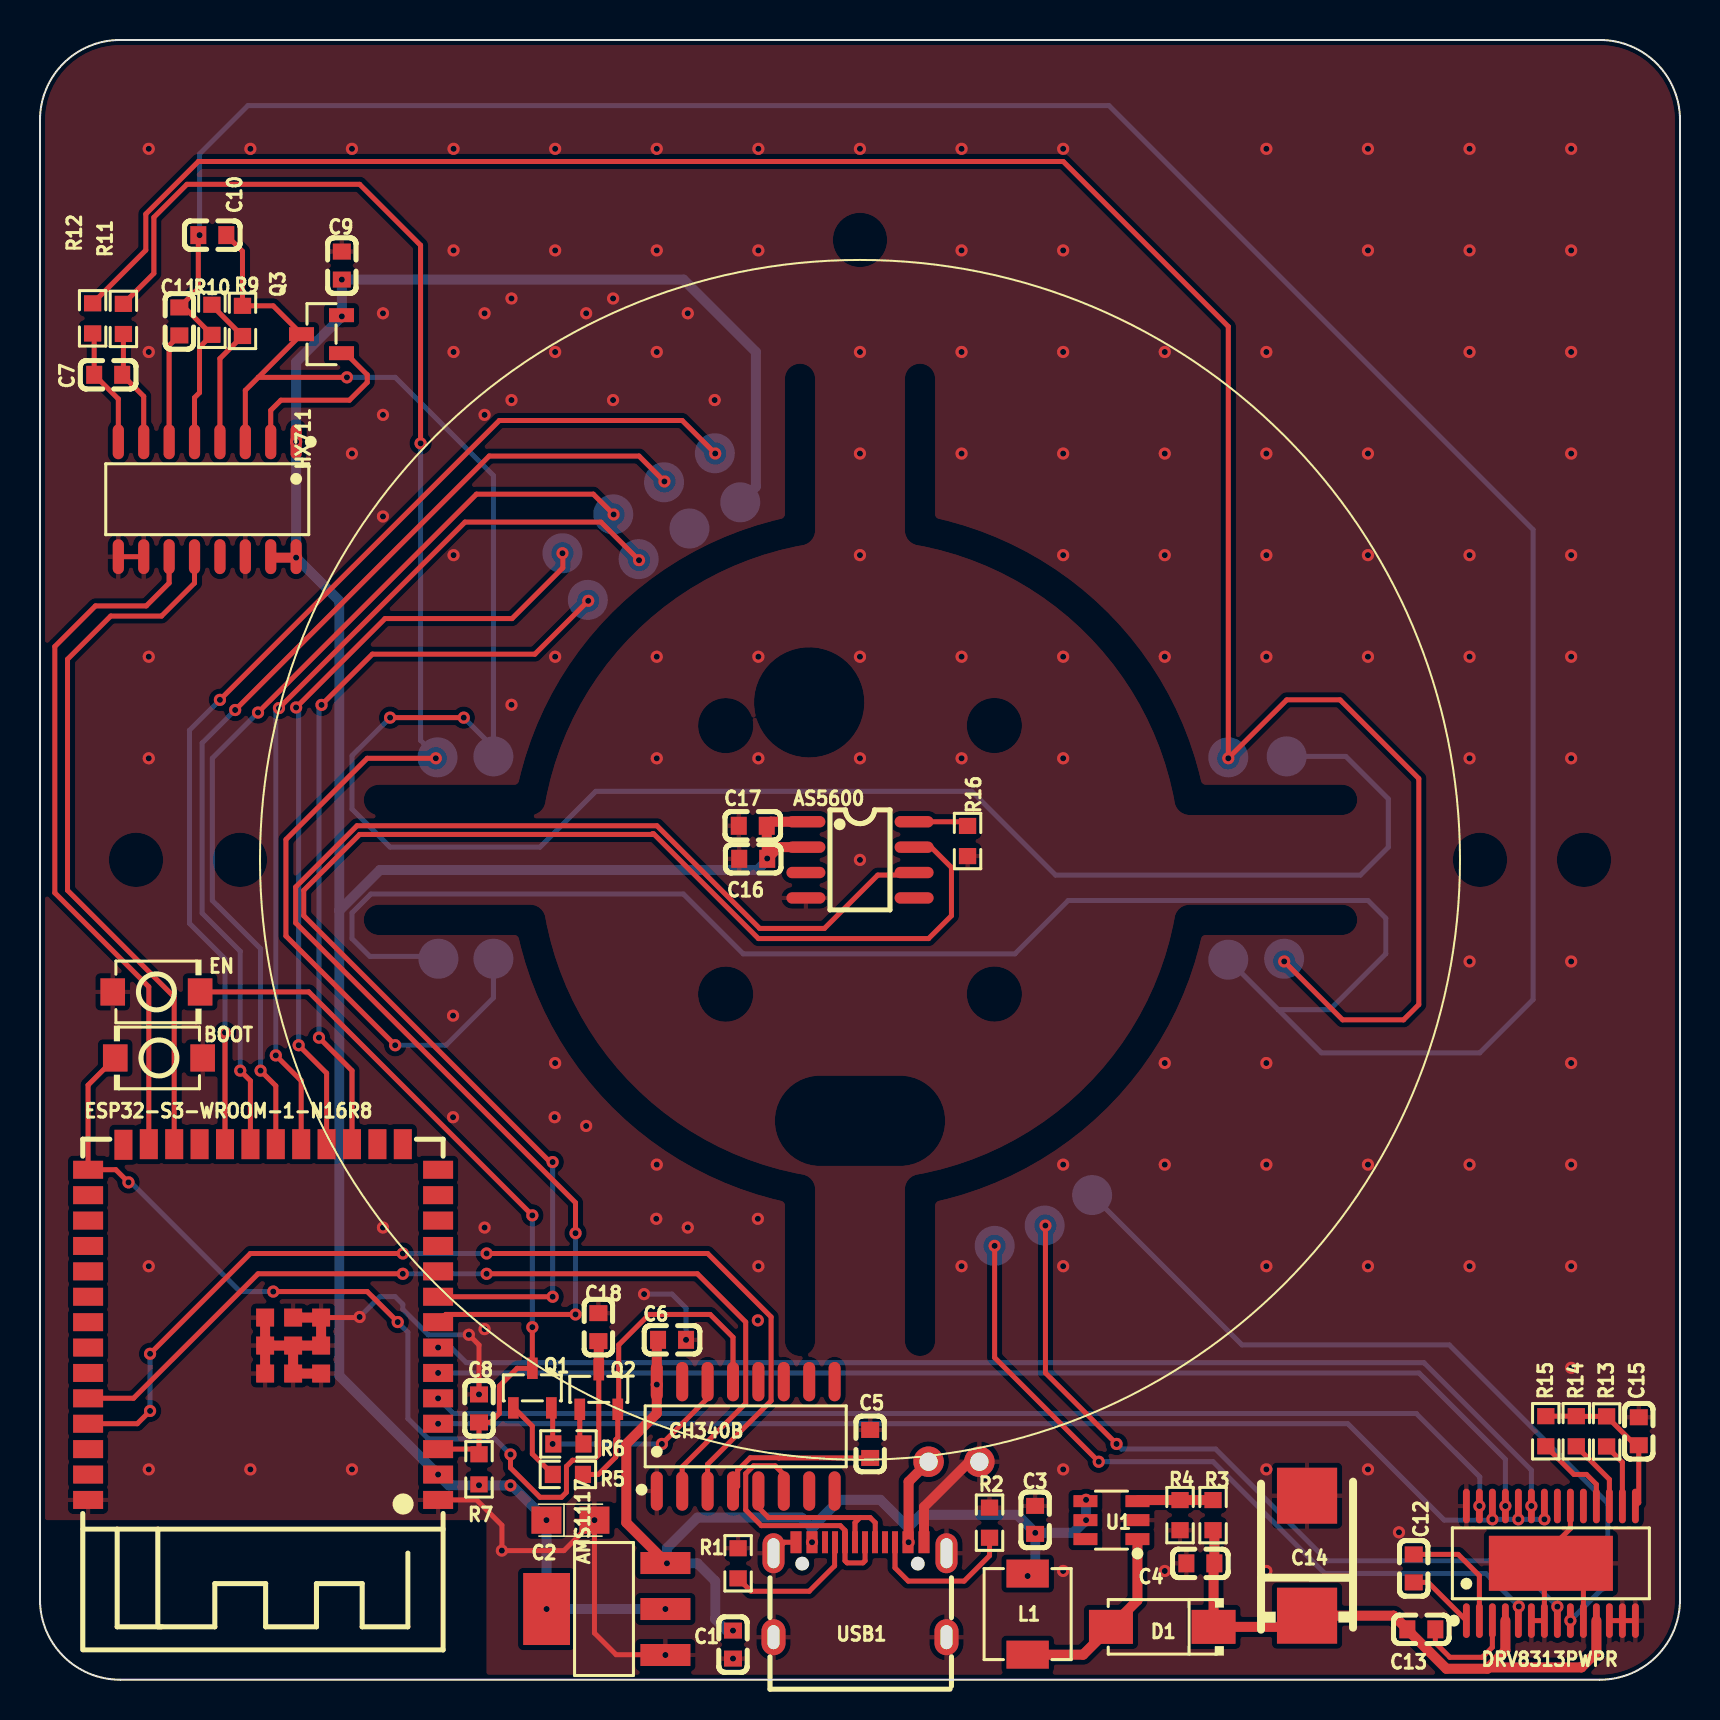
[diagram p4: board, top side]
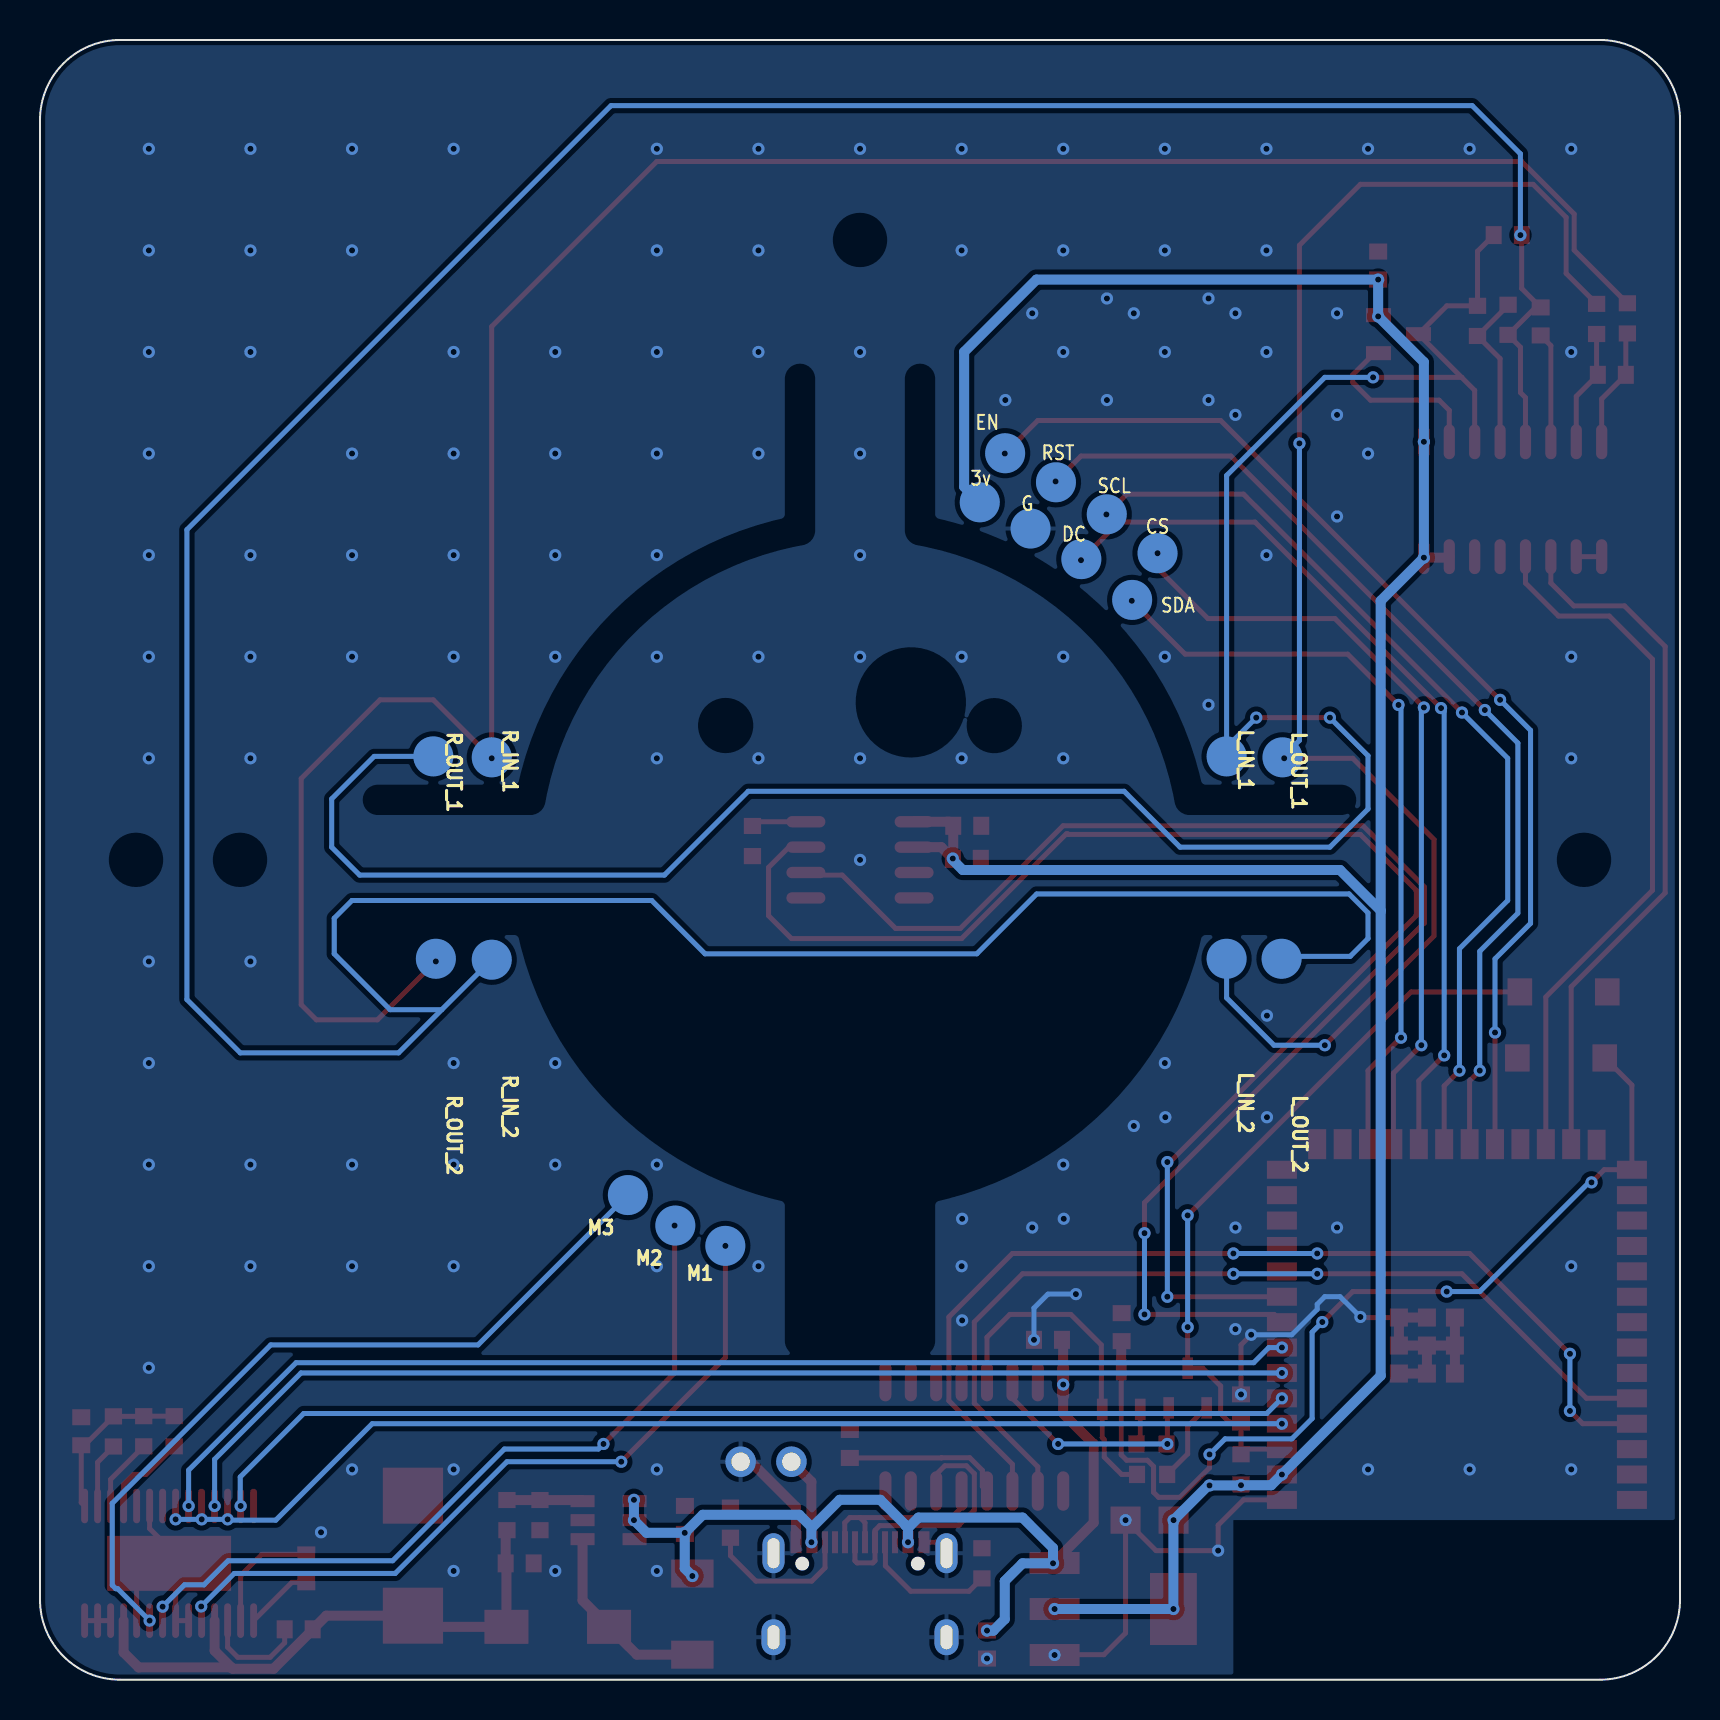
[diagram p5: board, bottom side, seen from below]

Outline 82 x 82 mm; copper layers: Top Layer, Bottom Layer. Coordinates in mm from the lower left corner of the outline.
Outline path: 0,78 0,4 arc(1.17,1.17) 4,0 78,0 arc(80.83,1.17) 82,4 82,78 arc(80.83,80.83) 78,82 4,82 arc(1.17,80.83) 0,78
Stack: Top Layer 0.035mm / Dielectric1 1.51mm FR4 er 4.5 / Bottom Layer 0.035mm

## Design rules (mm)
template: 用户自定义配置
spacing safeClearance (default): track to track 0.152, other pairs 0 to 0.3
track width trackWidth (default): min 0.127, default 0.254, max 2.54
differential pair differentialPair (default): width min 0.127, default 0.254, max 2.54; gap min 0.152, default 0.152
via viaSize (default): diameter min 0.5, default 0.61, max 10; hole min 0.3, default 0.305, max 5.999

## Placement (name value [footprint] x y rotation side)
AMS1117  AMS1117-3.3  [SOT-223-3_L6.5-W3.4-P2.30-LS7.0-BR]  28.3 3.53 0 top
AS5600  AS5600-ASOT  [SOIC-8_L5.0-W4.0-P1.27-LS6.0-BL]  41 41 270 top
BOOT  TS-1088R-02026  [SW-SMD_L3.9-W3.0-P4.45]  5.95 31.09 180 top
C1  10uF  [C0603]  34.65 1.76 90 top
C2  22uF  [CASE-A_3216]  26.52 7.98 0 top
C3  22uF  [C0603]  49.76 7.99 270 top
C4  22uF  [C0603]  58.02 5.82 0 top
C5  100nF  [C0603]  41.51 11.79 270 top
C6  100nF  [C0603]  31.6 17 180 top
C7  100nF  [C0603]  3.41 65.26 0 top
C8  100nF  [C0603]  21.95 13.57 270 top
C9  10uF  [C0603]  15.09 70.72 270 top
C10  10uF  [C0603]  8.61 72.24 0 top
C11  100nF  [C0603]  6.97 67.92 90 top
C12  100nF  [C0603]  68.69 5.57 270 top
C13  100nF  [C0603]  69.07 2.52 0 top
C14  100uF  [CASE-D_7343]  63.35 6.2 270 top
C15  470nF  [C0603]  79.94 12.43 270 top
C16  100nF  [C0603]  35.66 41.05 0 top
C17  10uF  [C0603]  35.64 42.7 0 top
C18  100nF  [C0603]  27.92 17.63 270 top
CH340B  CH340B  [SOIC-16_L9.9-W3.9-P1.27-LS6.0-BL]  35.28 12.17 0 top
D1  SS14  [SMA_L4.2-W2.6-LS5.3-RD]  56.11 2.64 180 top
DRV8313PWPR  DRV8313PWPR  [HTSSOP-28_L9.8-W4.5-P0.65-LS6.6-BL-EP]  75.54 5.82 0 top
EN  TS-1088R-02026  [SW-SMD_L3.9-W3.0-P4.45]  5.82 34.4 0 top
ESP32-S3-WROOM-1-N16R8  ESP32-S3-WROOM-1-N16R8  [WIRELM-SMD_ESP32-S3-WROOM-1]  11.16 17.89 180 top
HX711  HX711  [SOP-16_L10.0-W3.9-P1.27-LS6.0-BL]  8.36 59.03 180 top
L1  4.7uH  [IND-SMD_L4.4-W4.2]  49.38 3.28 90 top
L_IN_1  -  [pad_1]  22.67 46.17 180 bottom
L_IN_2  -  [pad_1]  22.67 36.05 180 bottom
L_OUT_1  -  [pad_1]  19.88 46.13 180 bottom
L_OUT_2  -  [pad_1]  19.92 36.05 180 bottom
M1  -  [pad_1]  47.73 21.7 180 bottom
M2  -  [pad_1]  50.23 22.71 180 bottom
M3  -  [pad_1]  52.61 24.24 180 bottom
NOREF  -  [Pad_e75]  46.97 10.9 0 top
NOREF#2  -  [Pad_e62]  44.43 10.9 0 top
Q1  S8050  [SOT-23-3_L2.9-W1.3-P1.90-LS2.3-BR]  24.62 14.58 270 top
Q2  S8050  [SOT-23-3_L2.9-W1.3-P1.90-LS2.3-BR]  27.94 14.51 270 top
Q3  S8550  [SOT-23-3_L2.9-W1.3-P1.90-LS2.4-BR]  14.08 67.29 0 top
R1  5.1kΩ  [R0603]  34.9 5.82 270 top
R2  5.1kΩ  [R0603]  47.48 7.85 270 top
R3  191kΩ  [R0603]  58.65 8.23 270 top
R4  10kΩ  [R0603]  57 8.23 90 top
R5  10kΩ  [R0603]  26.4 10.27 180 top
R6  10kΩ  [R0603]  26.42 11.79 0 top
R7  10kΩ  [R0603]  21.95 10.52 270 top
R9  10kΩ  [R0603]  10.12 67.95 90 top
R10  8.2kΩ  [R0603]  8.59 68.01 90 top
R11  100Ω  [R0603]  4.17 68.05 270 top
R12  100Ω  [R0603]  2.63 68.08 270 top
R13  10kΩ  [R0603]  78.33 12.42 270 top
R14  10kΩ  [R0603]  76.81 12.43 270 top
R15  10kΩ  [R0603]  75.29 12.43 270 top
R16  10kΩ  [R0603]  46.38 41.94 90 top
R_IN_1  -  [pad_1]  59.41 46.13 180 bottom
R_IN_2  -  [pad_1]  59.41 36.01 180 bottom
R_OUT_1  -  [pad_1]  62.33 46.17 180 bottom
R_OUT_2  -  [pad_1]  62.21 36.05 180 bottom
U1  MT3608L  [SOT-23-6_L2.9-W1.6-P0.95-LS2.8-BL_3]  53.57 7.98 90 top
U4  -  [pad_1]  32.47 57.57 180 bottom
U5  -  [pad_1]  35.01 58.88 180 bottom
U6  -  [pad_1]  33.74 61.33 180 bottom
U7  -  [pad_1]  29.93 56.04 180 bottom
U8  -  [pad_1]  26.12 56.33 180 bottom
U9  -  [pad_1]  28.66 58.28 180 bottom
U10  -  [pad_1]  27.39 54 180 bottom
U11  -  [pad_1]  31.2 59.88 180 bottom
USB1  TYPE-C 16PIN 2MD(073)  [USB-C-SMD_TYPE-C-6PIN-2MD-073]  41 4.5 0 top

## Footprints (pads in the part's own frame, mm; a bottom-side part is the same pattern mirrored in y, then rotated)
C0603
  rect 0.8x0.9 smd: 1(-0.7,0) 2(0.7,0)
CASE-A_3216
  rect 1.5x1.359 smd: 1(-1.2,0) 2(1.2,0)
CASE-D_7343
  rect 2.799x3.01 smd: 1(3,0) 2(-3,0)
HTSSOP-28_L9.8-W4.5-P0.65-LS6.6-BL-EP
  oval 0.343x1.732 smd: 1(-4.225,-2.866) 2(-3.575,-2.866) 3(-2.925,-2.866) 4(-2.275,-2.866) 5(-1.625,-2.866) 6(-0.975,-2.866) 7(-0.325,-2.866) 8(0.325,-2.866) 9(0.975,-2.866) 10(1.625,-2.866) 11(2.275,-2.866) 12(2.925,-2.866) 13(3.575,-2.866) 14(4.225,-2.866) 15(4.225,2.866) 16(3.575,2.866) 17(2.925,2.866) 18(2.275,2.866) 19(1.625,2.866) 20(0.975,2.866) 21(0.325,2.866) 22(-0.325,2.866) 23(-0.975,2.866) 24(-1.625,2.866) 25(-2.275,2.866) 26(-2.925,2.866) 27(-3.575,2.866) 28(-4.225,2.866)
  rect 6.2x2.75 smd: 29(0,0)
IND-SMD_L4.4-W4.2
  rect 1.4x2.12 smd: 1(2.028,0) 2(-2.028,0)
pad_1
  round 2 smd: 1(0,0)
Pad_e62
  round 1.524 hole 0.914: 1(0,0)
Pad_e75
  round 1.524 hole 0.914: 1(0,0)
R0603
  rect 0.806x0.864 smd: 1(-0.753,0) 2(0.753,0)
SMA_L4.2-W2.6-LS5.3-RD
  rect 2.2x1.7 smd: 1(-2.566,0) 2(2.566,0)
SOIC-8_L5.0-W4.0-P1.27-LS6.0-BL
  oval 0.569x1.95 smd: 1(-1.905,-2.705) 2(-0.635,-2.705) 3(0.635,-2.705) 4(1.905,-2.705) 5(1.905,2.705) 6(0.635,2.705) 7(-0.635,2.705) 8(-1.905,2.705)
SOIC-16_L9.9-W3.9-P1.27-LS6.0-BL
  oval 0.602x1.971 smd: 1(-4.445,-2.736) 2(-3.175,-2.736) 3(-1.905,-2.736) 4(-0.635,-2.736) 5(0.635,-2.736) 6(1.905,-2.736) 7(3.175,-2.736) 8(4.445,-2.736) 9(4.445,2.736) 10(3.175,2.736) 11(1.905,2.736) 12(0.635,2.736) 13(-0.635,2.736) 14(-1.905,2.736) 15(-3.175,2.736) 16(-4.445,2.736)
SOP-16_L10.0-W3.9-P1.27-LS6.0-BL
  oval 0.56x1.745 smd: 1(-4.445,-2.873) 2(-3.175,-2.873) 3(-1.905,-2.873) 4(-0.635,-2.873) 5(0.635,-2.873) 6(1.905,-2.873) 7(3.175,-2.873) 8(4.445,-2.873) 9(4.445,2.873) 10(3.175,2.873) 11(1.905,2.873) 12(0.635,2.873) 13(-0.635,2.873) 14(-1.905,2.873) 15(-3.175,2.873) 16(-4.445,2.873)
SOT-23-3_L2.9-W1.3-P1.90-LS2.3-BR
  rect 1.07x0.532 smd: 1(0.99,-0.95) 2(0.99,0.95) 3(-0.99,0)
SOT-23-3_L2.9-W1.3-P1.90-LS2.4-BR
  rect 1.25x0.7 smd: 1(1,-0.95) 2(1,0.95) 3(-1,0)
SOT-23-6_L2.9-W1.6-P0.95-LS2.8-BL_3
  rect 0.6x1.2 smd: 1(-0.95,-1.3) 2(0,-1.3) 3(0.95,-1.3) 4(0.95,1.3) 5(0,1.3) 6(-0.95,1.3)
SOT-223-3_L6.5-W3.4-P2.30-LS7.0-BR
  rect 2.5x1.1 smd: 1(2.97,-2.3) 2(2.97,0) 3(2.97,2.3)
  rect 2.34x3.6 smd: 4(-2.97,0)
SW-SMD_L3.9-W3.0-P4.45
  rect 1.23x1.36 smd: 1(-2.185,0) 2(2.185,0)
USB-C-SMD_TYPE-C-6PIN-2MD-073
  rect 0.55x1.1 smd: 1(-3.2,2.375) 2(-2.4,2.375) 11(2.4,2.375) 12(3.2,2.375)
  rect 0.3x1.1 smd: 3(-1.75,2.375) 4(-1.25,2.375) 5(-0.75,2.375) 6(-0.25,2.375) 7(0.25,2.375) 8(0.75,2.375) 9(1.25,2.375) 10(1.75,2.375)
  oval 1.1x2 hole 0.6x1.5: 13(-4.325,1.825) 14(4.325,1.825)
  oval 1.2x1.8 hole 0.6x1.2: 13(-4.325,-2.375) 14(4.325,-2.375)
WIRELM-SMD_ESP32-S3-WROOM-1
  rect 1.5x0.9 smd: 1(-8.75,8.895) 2(-8.75,7.625) 3(-8.75,6.355) 4(-8.75,5.085) 5(-8.75,3.815) 6(-8.75,2.545) 7(-8.75,1.275) 8(-8.75,0.005) 9(-8.75,-1.265) 10(-8.75,-2.535) 11(-8.75,-3.805) 12(-8.75,-5.075) 13(-8.75,-6.345) 14(-8.75,-7.615) 27(8.75,-7.615) 28(8.75,-6.345) 29(8.75,-5.075) 30(8.75,-3.805) 31(8.75,-2.535) 32(8.75,-1.265) 33(8.75,0.005) 34(8.75,1.275) 35(8.75,2.545) 36(8.75,3.815) 37(8.75,5.085) 38(8.75,6.355) 39(8.75,7.625) 40(8.75,8.895)
  rect 0.9x1.5 smd: 15(-6.985,-8.895) 16(-5.715,-8.895) 17(-4.445,-8.895) 18(-3.175,-8.895) 19(-1.905,-8.895) 20(-0.635,-8.895) 21(0.635,-8.895) 22(1.905,-8.895) 23(3.175,-8.895) 24(4.445,-8.895) 25(5.715,-8.895) 26(6.985,-8.865)
  rect 0.9x0.9 smd: 41(-2.9,2.575) 41(-2.9,1.175) 41(-2.9,-0.225) 41(-1.5,2.575) 41(-1.5,1.175) 41(-1.5,-0.225) 41(-0.1,2.575) 41(-0.1,1.175) 41(-0.1,-0.225)

## Nets
As in the schematic, except:
+5V: AMS1117.3 C1.2 C3.2 C6.2 CH340B.16 L1.1 NOREF#2.1 U1.4 U1.5 USB1.2 USB1.11
GND: AMS1117.1 AS5600.4 BOOT.1 C1.1 C2.2 C3.1 C4.1 C5.1 C6.1 C8.1 C9.1 C14.2 C15.1 C16.1 C17.1 C18.1 CH340B.1 DRV8313PWPR.6 DRV8313PWPR.7 DRV8313PWPR.10 DRV8313PWPR.12 DRV8313PWPR.13 DRV8313PWPR.14 DRV8313PWPR.20 DRV8313PWPR.28 DRV8313PWPR.29 EN.1 ESP32-S3-WROOM-1-N16R8.1 ESP32-S3-WROOM-1-N16R8.40 ESP32-S3-WROOM-1-N16R8.41 HX711.9 HX711.10 HX711.14 NOREF.1 R1.1 R2.1 R4.1 R16.1 U1.2 U4.1 USB1.1 USB1.12 USB1.13 USB1.14

Pads without a net: AS5600 3 5; CH340B 7 8 9 10 11 12 15; DRV8313PWPR 19 21; ESP32-S3-WROOM-1-N16R8 10 11 12 13 14 15 16 23 26 28 29 30 31 32 33 34 35 38 39; HX711 13; U1 6; USB1 3 9

## Via types
v1: diameter 0.61, hole 0.305, Top Layer to Bottom Layer, 218 vias

## Routing (per net, layer and track width the routed paths; a pad name or vN(x,y) marks a point on that pad's centre or on a via; arc(x,y) is an arc through that point)
+3.3V: length 140
  Top Layer w0.5: 36.49,41.19 36.37,41.07 v1(36.36,41.07) ; 36.49,41.19 36.34,41.34 C17.2 36.54,42.91 AS5600.1 ; 36.49,41.19 36.94,41.64 AS5600.2 ; HX711.15 11.58,56.11 v1(12.81,56.11)
  Bottom Layer w0.5: 14.97,38.46 14.97,15.2 v1(19.91,10.26) 20.44,9.72 v1(21.95,9.72) 21.96,9.72 v1(23.52,9.72) 23.59,9.72 v1(25.32,7.98) 25.33,7.97 v1(25.33,3.53) ; 14.97,38.46 17,40.49 35.86,40.49 36.36,40.99 v1(36.36,41.07) ; 14.97,38.46 14.97,53.95 v1(12.81,56.11) v1(12.81,61.91) 12.81,65.89 v1(15.09,68.18) v1(15.09,70.02) 32.18,70.02 35.79,66.4 35.79,59.66 U5.1 ; v1(31.27,3.53) 25.38,3.53
+5V: length 52.3
  Top Layer w0.5: v1(43.43,6.88) 43.43,9.9 NOREF#2.1 ; C6.2 30.84,16.94 v1(30.84,14.76) 30.84,13.31 29.32,11.79 29.32,7.85 v1(31.35,5.82)
  Bottom Layer w0.5: 38.6,7.59 38.08,8.11 32.87,8.11 31.35,6.58 v1(31.35,5.82) 32.87,5.82 33.76,4.93 33.76,3.03 34.33,2.46 v1(34.65,2.46) ; 38.6,7.59 v1(38.6,6.88) ; 38.6,7.59 38.73,7.71 38.73,7.74 39.98,9 42.02,9 43.4,7.61 ; v1(49.76,7.34) 51.67,7.34 v1(52.3,7.98) v1(52.3,9) ; v1(49.76,7.34) 49.76,5.57 v1(49.38,5.19) ; v1(49.76,7.34) 48.86,8.25 44.03,8.25 43.43,7.64 v1(43.43,6.88)
+12V: length 30
  Top Layer w0.5: 72.43,0.61 72.37,0.55 70.32,0.55 68.37,2.5 C13.1 67.68,3.2 C14.1 62.79,2.64 D1.1 58.68,5.78 C4.2 58.72,7.41 58.65,7.48 ; 72.43,0.61 77.07,0.61 77.82,1.37 77.82,2.96 ; 72.43,0.61 73.27,1.45 73.27,2.96
GND: length 65.5
  Top Layer w0.25: v1(21.95,14.27) 21.95,16.74 v1(21.44,17.25) ; ESP32-S3-WROOM-1-N16R8.1 21.83,8.99 23.09,7.73 v1(23.09,6.46) 26.2,6.46 v1(27.72,7.98) 27.72,2.34 28.81,1.25 31.26,1.25 v1(31.27,1.24) ; 76.04,6.32 76.04,7.08 76.52,7.56 DRV8313PWPR.20 ; 79.77,2.96 78.47,2.96 ; USB1.13 37.22,6.88 USB1.1 ; v1(15.98,18.14) 15.95,18.11 ESP32-S3-WROOM-1-N16R8.41 ; 77.17,2.96 77.17,5.2 77.04,5.32 76.04,5.32 ; 75.04,5.32 75.22,5.15 75.22,2.96 74.57,2.96 ; HX711.9 HX711.10
  Top Layer w0.5: 11.25,16.71 ESP32-S3-WROOM-1-N16R8.41 ; 11.25,16.71 ESP32-S3-WROOM-1-N16R8.41 ; 11.25,16.71 12.66,16.71 ; 12.66,16.71 14.06,16.71 ESP32-S3-WROOM-1-N16R8.41 ESP32-S3-WROOM-1-N16R8.41 ; 12.66,16.71 ESP32-S3-WROOM-1-N16R8.41 ESP32-S3-WROOM-1-N16R8.41 ; NOREF.1 46.46,10.9 44.2,8.64 USB1.12
  Bottom Layer w0.25: v1(15.98,18.14) 17,19.16 17.76,19.16 18.14,18.78 18.14,18.52 19.41,17.25 v1(21.44,17.25) ; v1(32.3,17) 32.3,18.58 31.6,19.28 v1(30.21,19.28)
  vias: v1(5.44,76.56) v1(5.44,66.4) v1(5.44,51.16) v1(5.44,46.08) v1(5.44,20.68) v1(5.44,10.52) v1(10.52,76.56) v1(10.52,10.52) v1(15.6,76.56) v1(15.6,61.32) v1(15.6,10.52) v1(17.15,68.33) v1(17.15,63.25) v1(17.15,58.17) v1(17.15,22.61) v1(20.68,76.56) v1(20.68,71.48) v1(20.68,66.4) v1(20.68,56.24) v1(20.65,33.21) v1(20.65,28.13) v1(22.23,68.33) v1(22.23,63.25) v1(22.23,22.61) v1(22.23,17.53) v1(23.57,69.07) v1(23.57,63.99) v1(23.57,48.75) v1(25.73,28.13) v1(25.76,76.56) v1(25.76,71.48) v1(25.76,66.4) v1(25.76,51.16) v1(25.76,30.84) v1(27.31,68.33) v1(27.31,27.69) v1(28.65,69.07) v1(28.65,63.99) v1(30.84,76.56) v1(30.84,71.48) v1(30.84,66.4) v1(30.84,51.16) v1(30.84,46.08) v1(30.84,25.76) v1(30.81,23.05) v1(32.39,68.33) v1(32.39,22.61) v1(33.73,63.99) v1(34.65,1.06) v1(35.92,76.56) v1(35.92,71.48) v1(35.92,51.16) v1(35.92,46.08) v1(35.89,23.05) v1(35.92,20.68) v1(35.89,17.97) v1(41,76.56) v1(41,66.4) v1(41,61.32) v1(41,56.24) v1(41,51.16) v1(41,46.08) v1(41,41) v1(46.08,76.56) v1(46.08,71.48) v1(46.08,66.4) v1(46.08,61.32) v1(46.08,51.16) v1(46.08,46.08) v1(46.08,20.68) v1(51.16,76.56) v1(51.16,71.48) v1(51.16,66.4) v1(51.16,61.32) v1(51.16,56.24) v1(51.16,51.16) v1(51.16,46.08) v1(51.16,25.76) v1(51.16,20.68) v1(51.16,10.52) v1(51.16,5.44) v1(56.24,66.4) v1(56.24,61.32) v1(56.24,56.24) v1(56.24,51.16) v1(56.24,30.84) v1(56.24,25.76) v1(56.24,5.44) v1(61.32,76.56) v1(61.32,66.4) v1(61.32,61.32) v1(61.32,56.24) v1(61.32,51.16) v1(61.32,30.84) v1(61.32,25.76) v1(61.32,20.68) v1(61.32,10.52) v1(61.32,5.44) v1(66.4,76.56) v1(66.4,71.48) v1(66.4,61.32) v1(66.4,56.24) v1(66.4,51.16) v1(66.4,25.76) v1(66.4,20.68) v1(66.4,10.52) v1(67.95,7.37) v1(71.48,76.56) v1(71.48,71.48) v1(71.48,66.4) v1(71.48,56.24) v1(71.48,51.16) v1(71.48,46.08) v1(71.48,35.92) v1(71.48,25.76) v1(71.48,20.68) v1(76.56,76.56) v1(76.56,71.48) v1(76.56,66.4) v1(76.56,61.32) v1(76.56,56.24) v1(76.56,51.16) v1(76.56,46.08) v1(76.56,35.92) v1(76.56,30.84) v1(76.56,25.76) v1(76.56,20.68) v1(76.56,15.6)
AS_SCL: length 72.2
  Top Layer w0.25: 19.91,19.15 v1(25.63,19.15) ; AS5600.7 44.56,41.64 45.57,40.62 45.57,38.21 44.43,37.06 35.92,37.06 30.68,42.3 30.62,42.3 30.59,42.27 15.98,42.27 13.19,39.48 13.19,38.21 25.51,25.89 v1(25.63,25.89)
  Bottom Layer w0.25: v1(25.63,19.15) v1(25.63,25.89)
AS_SDA: length 69.7
  Top Layer w0.25: v1(26.78,22.33) 26.78,23.86 12.78,37.85 12.78,39.64 15.85,42.7 30.85,42.7 35.98,37.57 39.22,37.57 41.89,40.24 43.58,40.24 AS5600.6 ; v1(26.78,18.27) 20.29,18.27 ESP32-S3-WROOM-1-N16R8.8
  Bottom Layer w0.25: v1(26.78,22.33) v1(26.78,18.27)
BACKLIGHT_EN: length 54.8
  Top Layer w0.25: v1(33.76,61.32) 32.11,62.97 22.97,62.97 v1(9,49) ; ESP32-S3-WROOM-1-N16R8.22 v1(9.25,32.36)
  Bottom Layer w0.25: v1(9,49) 7.47,47.48 7.47,37.83 9.25,36.05 v1(9.25,32.36)
CHIP_PU: length 37.2
  Top Layer w0.25: v1(24.62,17.63) Q1.3 23.85,15.57 22.97,14.69 22.97,13.31 22.52,12.87 C8.2 R7.1 21.69,11.53 ESP32-S3-WROOM-1-N16R8.3 ; EN.2 13.44,34.4 v1(24.62,23.22)
  Bottom Layer w0.25: v1(24.62,23.22) v1(24.62,17.63)
DTR: length 16.7
  Top Layer w0.25: R5.1 27.92,10.27 28.79,11.14 28.79,12.01 28.89,12.11 28.89,13.52 28.94,13.57 28.94,16.74 30.46,18.27 33.51,18.27 34.65,17.12 CH340B.13
GPIO_0: length 48.7
  Top Layer w0.25: 3.76,31.09 2.41,29.74 ESP32-S3-WROOM-1-N16R8.27 2.41,25.51 3.79,25.51 v1(4.42,24.87) ; v1(17.89,17.89) 16.36,19.41 v1(11.66,19.41) ; v1(23.52,11.26) 23.52,10.6 25,9.12 26.07,9.12 26.32,9.37 26.32,10.67 26.63,10.98 27.67,10.98 27.94,11.25 Q2.3
  Top Layer w0.5: Q2.3 27.94,16.91 C18.2
  Bottom Layer w0.25: v1(4.42,24.87) 4.55,24.87 10.01,19.41 v1(11.66,19.41) ; v1(17.89,17.89) 18.39,17.38 18.39,13.06 19.41,12.04 22.75,12.04 v1(23.52,11.26)
LCD_CS: length 39.3
  Top Layer w0.25: v1(12.93,31.73) 14.33,30.33 ESP32-S3-WROOM-1-N16R8.18 ; v1(12.81,48.62) 17.25,53.06 23.6,53.06 26.14,55.61 26.14,56.24
  Bottom Layer w0.25: v1(12.93,31.73) 12.93,48.49 v1(12.81,48.62)
  vias: v1(26.12,56.33)
LCD_DC: length 45
  Top Layer w0.25: v1(11.79,31.22) 13.06,29.95 ESP32-S3-WROOM-1-N16R8.19 ; v1(11.95,48.59) 21.25,57.89 28.05,57.89 v1(29.95,55.99)
  Bottom Layer w0.25: v1(11.95,48.59) 11.79,48.43 v1(11.79,31.22)
LCD_SCL: length 46.6
  Top Layer w0.25: v1(11.03,30.46) 11.79,29.7 ESP32-S3-WROOM-1-N16R8.20 ; v1(28.68,58.27) 27.66,59.29 21.82,59.29 v1(10.9,48.37)
  Bottom Layer w0.25: v1(11.03,30.46) 11.03,36.56 8.61,38.97 8.61,46.08 v1(10.9,48.37)
LCD_SDA: length 38.2
  Top Layer w0.25: ESP32-S3-WROOM-1-N16R8.17 15.6,30.46 v1(13.95,32.11) ; v1(14.08,48.75) 16.62,51.29 24.74,51.29 v1(27.41,53.95)
  Bottom Layer w0.25: v1(14.08,48.75) 13.95,48.62 v1(13.95,32.11)
MOTOR_EN: length 57.3
  Bottom Layer w0.25: v1(75.22,8.02) v1(73.92,8.02) v1(72.62,8.02) 72.58,7.98 70.21,7.98 65.39,12.8 v1(19.91,12.8)
MOTOR_IN1: length 55.2
  Bottom Layer w0.25: v1(71.97,8.69) 71.99,8.71 71.99,10.14 68.81,13.31 20.66,13.31 v1(19.91,14.07)
MOTOR_IN2: length 57.5
  Bottom Layer w0.25: v1(19.91,15.34) 68.95,15.34 73.27,11.02 v1(73.27,8.69)
MOTOR_IN3: length 59
  Bottom Layer w0.25: v1(19.91,16.61) 20.56,16.61 21.31,15.85 69.19,15.85 74.57,10.48 v1(74.57,8.69)
MOTOR_OUT1: length 37
  Top Layer w0.25: v1(47.73,21.7) 47.73,16.11 v1(52.94,10.9)
  Bottom Layer w0.25: v1(52.94,10.9) 58.65,10.9 64.24,5.31 72.29,5.31 v1(73.94,3.66)
MOTOR_OUT2: length 37.8
  Top Layer w0.25: v1(50.27,22.71) 50.27,15.35 v1(53.83,11.79)
  Bottom Layer w0.25: v1(75.87,3.65) 74.78,4.74 73.81,4.74 72.6,5.95 64.37,5.95 58.78,11.54 54.08,11.54 v1(53.83,11.79)
MOTOR_OUT3: length 38.9
  Bottom Layer w0.25: M3.1 60.1,16.74 70.46,16.74 78.39,8.82 78.39,4.73 78.21,4.55 78.12,4.55 v1(76.52,2.96)
RESET: length 50.6
  Top Layer w0.25: v1(31.22,59.92) 29.95,61.19 22.46,61.19 v1(9.76,48.49) ; v1(10.01,30.46) 10.52,29.95 ESP32-S3-WROOM-1-N16R8.21
  Bottom Layer w0.25: v1(10.01,30.46) 10.01,36.43 8.11,38.33 8.11,46.84 v1(9.76,48.49)
RTS: length 11.4
  Top Layer w0.25: v1(31.09,11.79) 33.38,14.08 CH340B.14 ; 25.57,13.59 25.63,13.53 v1(25.63,11.79)
  Bottom Layer w0.25: v1(31.09,11.79) v1(25.63,11.79)
STRAIN_DO: length 35.7
  Top Layer w0.25: HX711.12 7.73,54.84 6.08,53.19 3.53,53.19 1.38,51.03 1.38,39.48 6.71,34.14 ESP32-S3-WROOM-1-N16R8.24
STRAIN_E+: length 117.4
  Top Layer w0.25: C10.2 10.12,71.43 R9.2 11.66,68.7 Q3.3 10.92,65.13 ; v1(15.35,65.13) 10.92,65.13 ; 10.92,65.13 10.27,64.48 HX711.3 ; v1(17.5,48.11) v1(21.19,48.11)
  Bottom Layer w0.25: v1(15.35,65.13) 17.76,65.13 22.67,60.22 22.67,46.63 ; v1(17.5,48.11) 15.6,46.21 15.6,43.54 17.5,41.64 25,41.64 27.79,44.43 46.59,44.43 50.78,40.24 66.02,40.24 67.42,41.64 67.42,44.05 65.29,46.17 R_OUT_1.1 ; 22.67,46.63 L_IN_1.1 ; 22.67,46.63 v1(21.19,48.11)
STRAIN_E-: length 203.3
  Top Layer w0.25: HX711.5 7.73,64.11 7.98,64.36 7.98,66.64 R10.1 7.22,68.62 C11.2 7.92,69.57 7.92,72.24
  Bottom Layer w0.25: 61.91,33.51 64.5,33.51 67.29,36.3 67.29,38.08 66.4,38.97 51.41,38.97 48.75,36.3 35.16,36.3 32.17,39.29 16.54,39.29 15.6,38.35 15.6,37.06 16.49,36.17 19.8,36.17 L_OUT_2.1 ; 61.91,33.51 R_IN_2.1 ; 61.91,33.51 64.07,31.35 71.99,31.35 74.66,34.02 74.66,57.51 53.45,78.72 10.39,78.72 7.98,76.31 v1(7.98,72.24)
STRAIN_S+: length 117.7
  Top Layer w0.25: R12.1 5.29,71.49 5.29,73.3 7.92,75.92 51.16,75.92 59.41,67.67 v1(59.41,46.08) 62.34,49 65,49 68.94,45.06 68.94,33.76 68.18,33 65.13,33 v1(62.21,35.92)
STRAIN_S-: length 75.8
  Top Layer w0.25: v1(19.79,46.08) 16.36,46.08 12.3,42.02 12.3,37.19 v1(17.76,31.73) ; R11.1 5.69,70.33 5.69,73.13 7.34,74.78 15.98,74.78 19.03,71.73 v1(19.03,61.83)
  Bottom Layer w0.25: L_IN_2.1 22.67,34.1 20.3,31.73 v1(17.76,31.73) ; L_OUT_1.1 19.03,46.97 v1(19.03,61.83)
STRAIN_SCK: length 35.2
  Top Layer w0.25: ESP32-S3-WROOM-1-N16R8.25 5.44,34.65 0.74,39.35 0.74,51.67 2.77,53.7 5.31,53.7 6.46,54.84 HX711.11
U0_RXD: length 46.2
  Top Layer w0.25: v1(18.14,20.3) 10.9,20.3 4.68,14.08 2.41,14.08 ESP32-S3-WROOM-1-N16R8.36 ; v1(22.33,20.3) 32.87,20.3 35.28,17.89 35.28,13.82 32.11,10.65 CH340B.2
  Bottom Layer w0.25: v1(22.33,20.3) v1(18.14,20.3)
U0_TXD: length 50.7
  Top Layer w0.25: CH340B.3 33.38,10.77 36.56,13.95 36.56,18.14 33.38,21.31 v1(22.33,21.31) ; ESP32-S3-WROOM-1-N16R8.37 4.86,12.8 v1(5.5,13.44) ; v1(5.5,16.3) 10.52,21.31 v1(18.14,21.31)
  Bottom Layer w0.25: v1(5.5,16.3) v1(5.5,13.44) ; v1(22.33,21.31) v1(18.14,21.31)
USB_D+: length 9.3
  Top Layer w0.25: USB1.6 40.75,7.86 41,8.11 ; USB1.8 41.76,6.89 41.76,7.85 41.51,8.11 41,8.11 ; CH340B.5 35.92,8.62 36.43,8.11 41,8.11
USB_D-: length 13.8
  Top Layer w0.25: CH340B.6 37.19,10.27 36.76,10.7 35.68,10.7 35.28,10.3 35.28,8.49 36.07,7.7 40.01,7.7 40.25,7.47 USB1.5 40.25,5.95 40.36,5.84 41.15,5.84 41.25,5.95 41.25,6.87 USB1.7
$1N3637: length 6.8
  Top Layer w0.25: R1.2 35.55,4.42 38.46,4.42 39.73,5.69 39.73,6.85 USB1.4
$1N3643: length 7.7
  Top Layer w0.25: R2.2 47.48,6.2 46.21,4.93 43.41,4.93 42.75,5.59 USB1.10
$1N5320: length 9.7
  Top Layer w0.5: 54.87,7.03 54.87,3.97 D1.2 52.16,1.25 L1.2
$1N5372: length 3.8
  Top Layer w0.5: 54.87,8.93 54.93,8.98 R4.2 R3.1
$1N8253: length 4.2
  Top Layer w0.25: Q1.1 23.7,13.59 24.62,12.68 24.62,11.29 R5.2
$1N8333: length 1.8
  Top Layer w0.25: 26.99,13.52 26.99,11.97 R6.2
$1N12316: length 9.1
  Top Layer w0.25: HX711.2 11.54,63.48 12.04,63.99 15.47,63.99 16.36,64.88 16.36,65.26 15.28,66.34 Q3.1
$1N12656: length 8
  Top Layer w0.25: R10.2 8.59,68.73 R9.1 9,66.07 HX711.4
$1N13236: length 5.5
  Top Layer w0.25: HX711.6 6.46,66.71 C11.1
$1N14367: length 5.9
  Top Layer w0.25: R11.2 4.17,65.32 C7.2 5.19,64.18 HX711.7
$1N14538: length 6
  Top Layer w0.25: R12.2 2.71,67.25 C7.1 3.92,64.05 HX711.8
$1N16382: length 3.4
  Top Layer w0.25: 71.32,2.96 69.41,4.87 C12.2
$1N16452: length 6
  Top Layer w0.25: C12.1 70.91,6.27 71.97,5.21 71.97,2.96
$1N16900: length 5.4
  Top Layer w0.25: 72.62,2.96 72.62,1.63 72.12,1.12 70.49,1.12 69.77,1.85 C13.2
$1N20514: length 8.4
  Top Layer w0.25: DRV8313PWPR.15 79.94,8.86 79.94,11.72 79.77,11.72 R13.1 76.82,13.17 R14.1 R15.1
$1N20610: length 3.3
  Top Layer w0.25: R13.2 79.12,10.87 DRV8313PWPR.16
$1N20702: length 3.7
  Top Layer w0.25: 78.47,8.69 78.47,10.02 R14.2
$1N20794: length 4.4
  Top Layer w0.25: R15.2 76.7,10.27 77.32,10.27 77.82,9.77 DRV8313PWPR.18
$1N22757: length 2.8
  Top Layer w0.25: AS5600.8 46.17,42.91 46.38,42.69
$1N33956: length 8
  Top Layer w0.25: CH340B.4 34.88,9.67 34.88,10.47 35.51,11.1 36.92,11.1 36.94,11.09 C5.2

## Copper pours and planes (outline as drawn; the poured copper is in the pictures)
GND on Top Layer: -2.05,83.16 85.45,83.16 85.45,-3.83 -2.05,-3.83
GND on Top Layer: -4.34,88.37 87.48,88.37 87.48,-6.5 -4.34,-6.5
GND on Bottom Layer: -9.55,86.85 123.55,86.85 123.55,-22.25 -9.55,-22.25

## Text on the board
Bottom Silkscreen Layer: SDA | CS | SCL | DC | RST | G | EN | 3v
